# EasyEDA Pro project ProPrj_SCH_usb_board_2025-02-15.epro

# Schematic joystick_board
Board Name: joystick_board; Create Date: 2025-02-15; Page Name: Sheet_1; Project Name: SCH_usb_board; Schematic Name: joystick_board; Update Date: 2025-02-15; Add into BOM: yes; Company: GJK; Convert to PCB: yes; Date: 2025-01-24; REV: 1.0; Sheet: 1/1
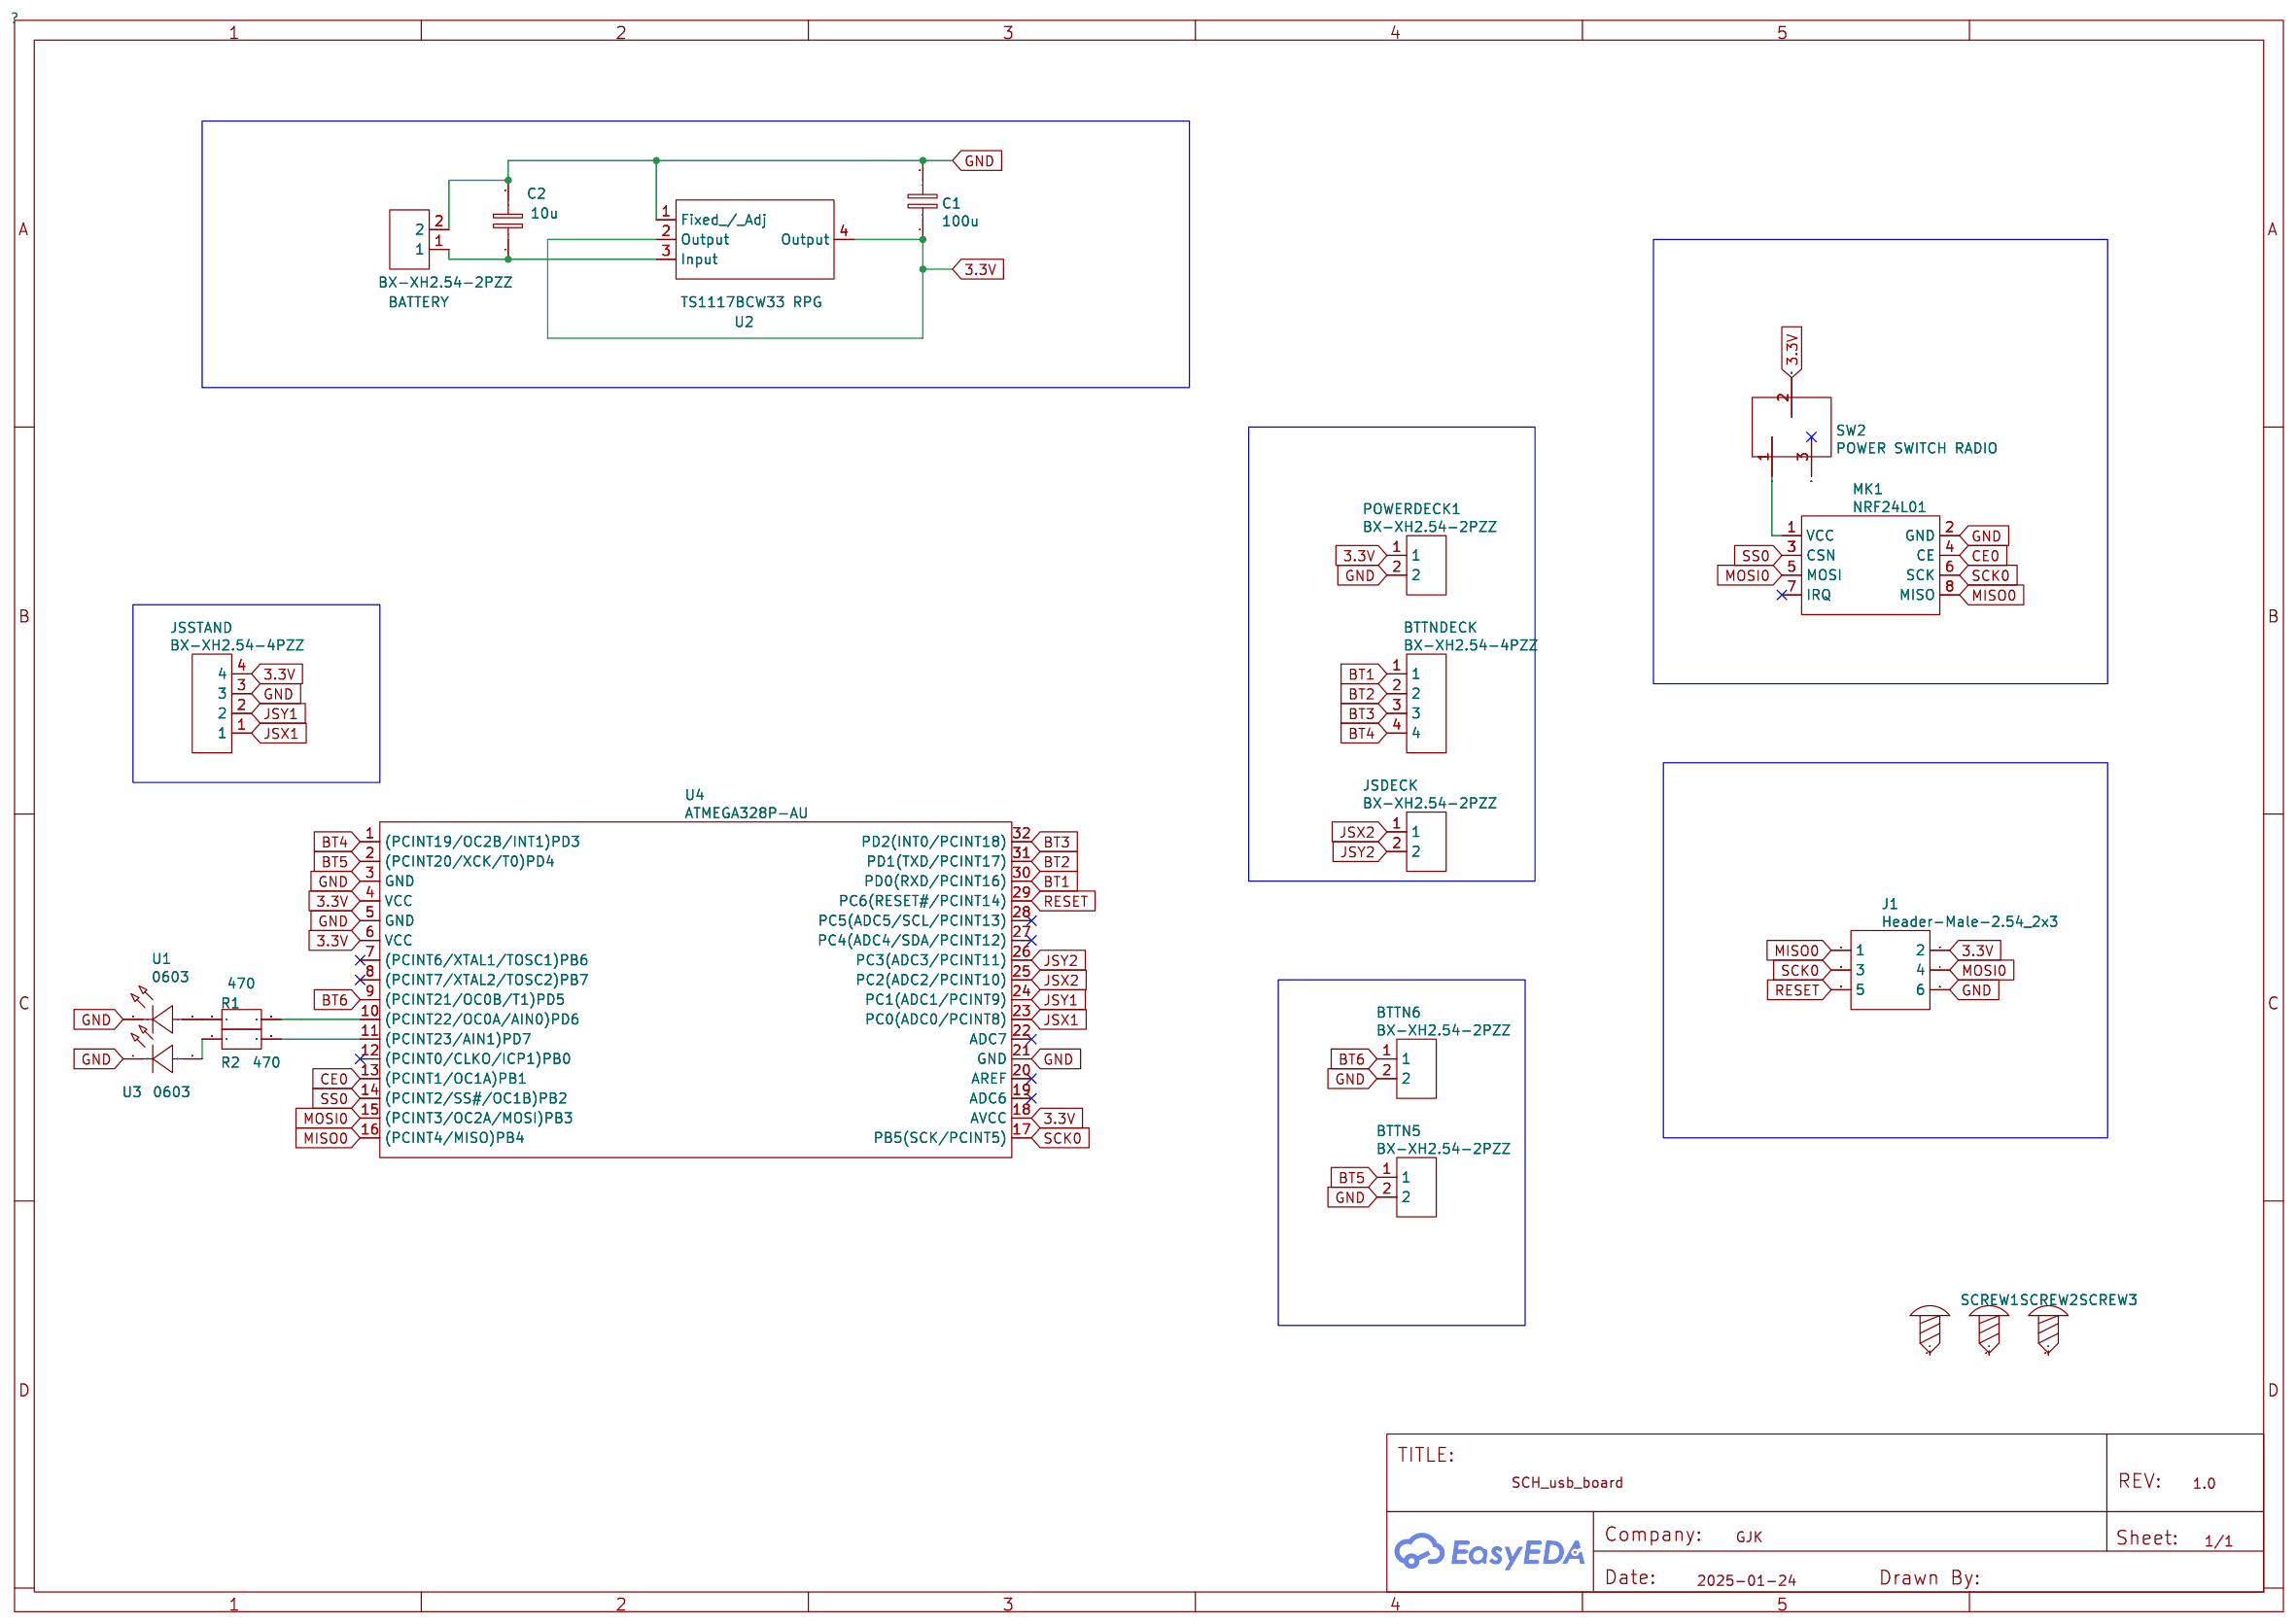
[diagram p0: schematic sheet]

## Parts
BATTERY  BX-XH2.54-2PZZ  [CONN-TH_2P-P2.50_BX-XH2.54-2PZZ]
BTTN5  BX-XH2.54-2PZZ  [CONN-TH_2P-P2.50_BX-XH2.54-2PZZ]
BTTN6  BX-XH2.54-2PZZ  [CONN-TH_2P-P2.50_BX-XH2.54-2PZZ]
BTTNDECK  BX-XH2.54-4PZZ  [CONN-TH_4P-P2.50_BX-XH2.54-4PZZ]
C1  100u  [C0603]
C2  10u  [C0603]
J1  Header-Male-2.54_2x3  [HDR-TH_6P-P2.54-V-M-R2-C3-S2.54-1]
JSDECK  BX-XH2.54-2PZZ  [CONN-TH_2P-P2.50_BX-XH2.54-2PZZ]
JSSTAND  BX-XH2.54-4PZZ  [CONN-TH_4P-P2.50_BX-XH2.54-4PZZ]
MK1  NRF24L01  [WIRELM-SMD_NRF24L01]
POWERDECK1  BX-XH2.54-2PZZ  [CONN-TH_2P-P2.50_BX-XH2.54-2PZZ]
R1  470  [R0603]
R2  470  [R0603]
SCREW1  -  [Screw-Hole-M3]
SCREW2  -  [Screw-Hole-M3]
SCREW3  -  [Screw-Hole-M3]
SW2  POWER SWITCH RADIO
U1  0603  [LED0603-RD_RED]
U2  TS1117BCW33 RPG  [SOT-223_L6.5-W3.5-P2.30-LS7.0-BR]
U3  0603  [LED0603-RD_RED]
U4  ATMEGA328P-AU  [TQFP-32_L7.0-W7.0-P0.80-LS9.0-BL]

## Library data of the parts
BATTERY BTTN5 BTTN6 JSDECK POWERDECK1 = BX-XH2.54-2PZZ: Supplier: LCSC; Supplier Part: C18077833; Manufacturer: Bossie(博锡); JLCPCB Part Class: Extended Part
BTTNDECK JSSTAND = BX-XH2.54-4PZZ: Supplier: LCSC; Supplier Part: C18077835; Manufacturer: Bossie(博锡); JLCPCB Part Class: Extended Part
C1 = 100u
C2 = 10u
J1 = Header-Male-2.54_2x3: Supplier: LCSC; Manufacturer: BOOMELE(博穆精密); Manufacturer Part: 2.54-2*3P针; Supplier Part: C65114; JLCPCB Part Class: Extended Part
MK1 = NRF24L01: Supplier: LCSC; Manufacturer: Ai-Thinker(安信可); Manufacturer Part: NF-04; Supplier Part: C90751; JLCPCB Part Class: Extended Part
R1 R2 = 470
SCREW1-SCREW3 = Screw-Hole-M3: Supplier Footprint: 插件
SW2 = POWER SWITCH RADIO: Supplier: LCSC; Manufacturer: KE; Manufacturer Part: DIP switch 8bit,Dip Switch,DSWB03LHGET; Supplier Part: C99420
U1 U3 = 0603: Supplier: LCSC; Supplier Part: C9900014602; Manufacturer: null; JLCPCB Part Class: Extended Part
U2 = TS1117BCW33 RPG: Supplier: LCSC; Supplier Part: C410833; Manufacturer: Taiwan Semiconductor(台湾半导体); JLCPCB Part Class: Extended Part
U4 = ATMEGA328P-AU: Supplier: LCSC; Manufacturer: MICROCHIP(美国微芯); Supplier Part: C14877; JLCPCB Part Class: Extended Part

## Nets
3.3V: C1.1 J1.2 JSSTAND.4 POWERDECK1.1 SW2.2(P2) U2.2(Output) U2.4(Output) U4.4(VCC) U4.6(VCC) U4.18(AVCC)
GND: BATTERY.2 BTTN5.2 BTTN6.2 C1.2 C2.2 J1.6 JSSTAND.3 MK1.2(GND) POWERDECK1.2 U1.1(K) U2.1(Fixed / Adj) U3.1(K) U4.3(GND) U4.5(GND) U4.21(GND)
BT1: BTTNDECK.1 U4.30(PD0(RXD/PCINT16))
BT2: BTTNDECK.2 U4.31(PD1(TXD/PCINT17))
BT3: BTTNDECK.3 U4.32(PD2(INT0/PCINT18))
BT4: BTTNDECK.4 U4.1((PCINT19/OC2B/INT1)PD3)
BT5: BTTN5.1 U4.2((PCINT20/XCK/T0)PD4)
BT6: BTTN6.1 U4.9((PCINT21/OC0B/T1)PD5)
CE0: MK1.4(CE) U4.13((PCINT1/OC1A)PB1)
JSX1: JSSTAND.1 U4.23(PC0(ADC0/PCINT8))
JSX2: JSDECK.1 U4.25(PC2(ADC2/PCINT10))
JSY1: JSSTAND.2 U4.24(PC1(ADC1/PCINT9))
JSY2: JSDECK.2 U4.26(PC3(ADC3/PCINT11))
MISO0: J1.1 MK1.8(MISO) U4.16((PCINT4/MISO)PB4)
MOSI0: J1.4 MK1.5(MOSI) U4.15((PCINT3/OC2A/MOSI)PB3)
RESET: J1.5 U4.29(PC6(RESET#/PCINT14))
SCK0: J1.3 MK1.6(SCK) U4.17(PB5(SCK/PCINT5))
SS0: MK1.3(CSN) U4.14((PCINT2/SS#/OC1B)PB2)
Net-(MK1-1): MK1.1(VCC) SW2.1(P1)
R2_1: R2.1 U3.2(A)
U1_2: R1.1 U1.2(A)
U2_3: BATTERY.1 C2.1 U2.3(Input)
U4_10: R1.2 U4.10((PCINT22/OC0A/AIN0)PD6)
U4_11: R2.2 U4.11((PCINT23/AIN1)PD7)

Not connected (* = marked no-connect by the designer): MK1 7(IRQ)*; SCREW1 1; SCREW2 1; SCREW3 1; SW2 3(P3)*; U4 7((PCINT6/XTAL1/TOSC1)PB6)* 8((PCINT7/XTAL2/TOSC2)PB7)* 12((PCINT0/CLKO/ICP1)PB0)* 19(ADC6)* 20(AREF)* 22(ADC7)* 27(PC4(ADC4/SDA/PCINT12))* 28(PC5(ADC5/SCL/PCINT13))*

# Schematic usb_board_32u4
Board Name: usb_board_32u4; Create Date: 2025-02-15; Page Name: Sheet_1; Project Name: SCH_usb_board; Schematic Name: usb_board_32u4; Update Date: 2025-02-15; Add into BOM: yes; Company: Your Company; Convert to PCB: yes; Date: 2025-02-09; REV: 1.0; Sheet: 1/1
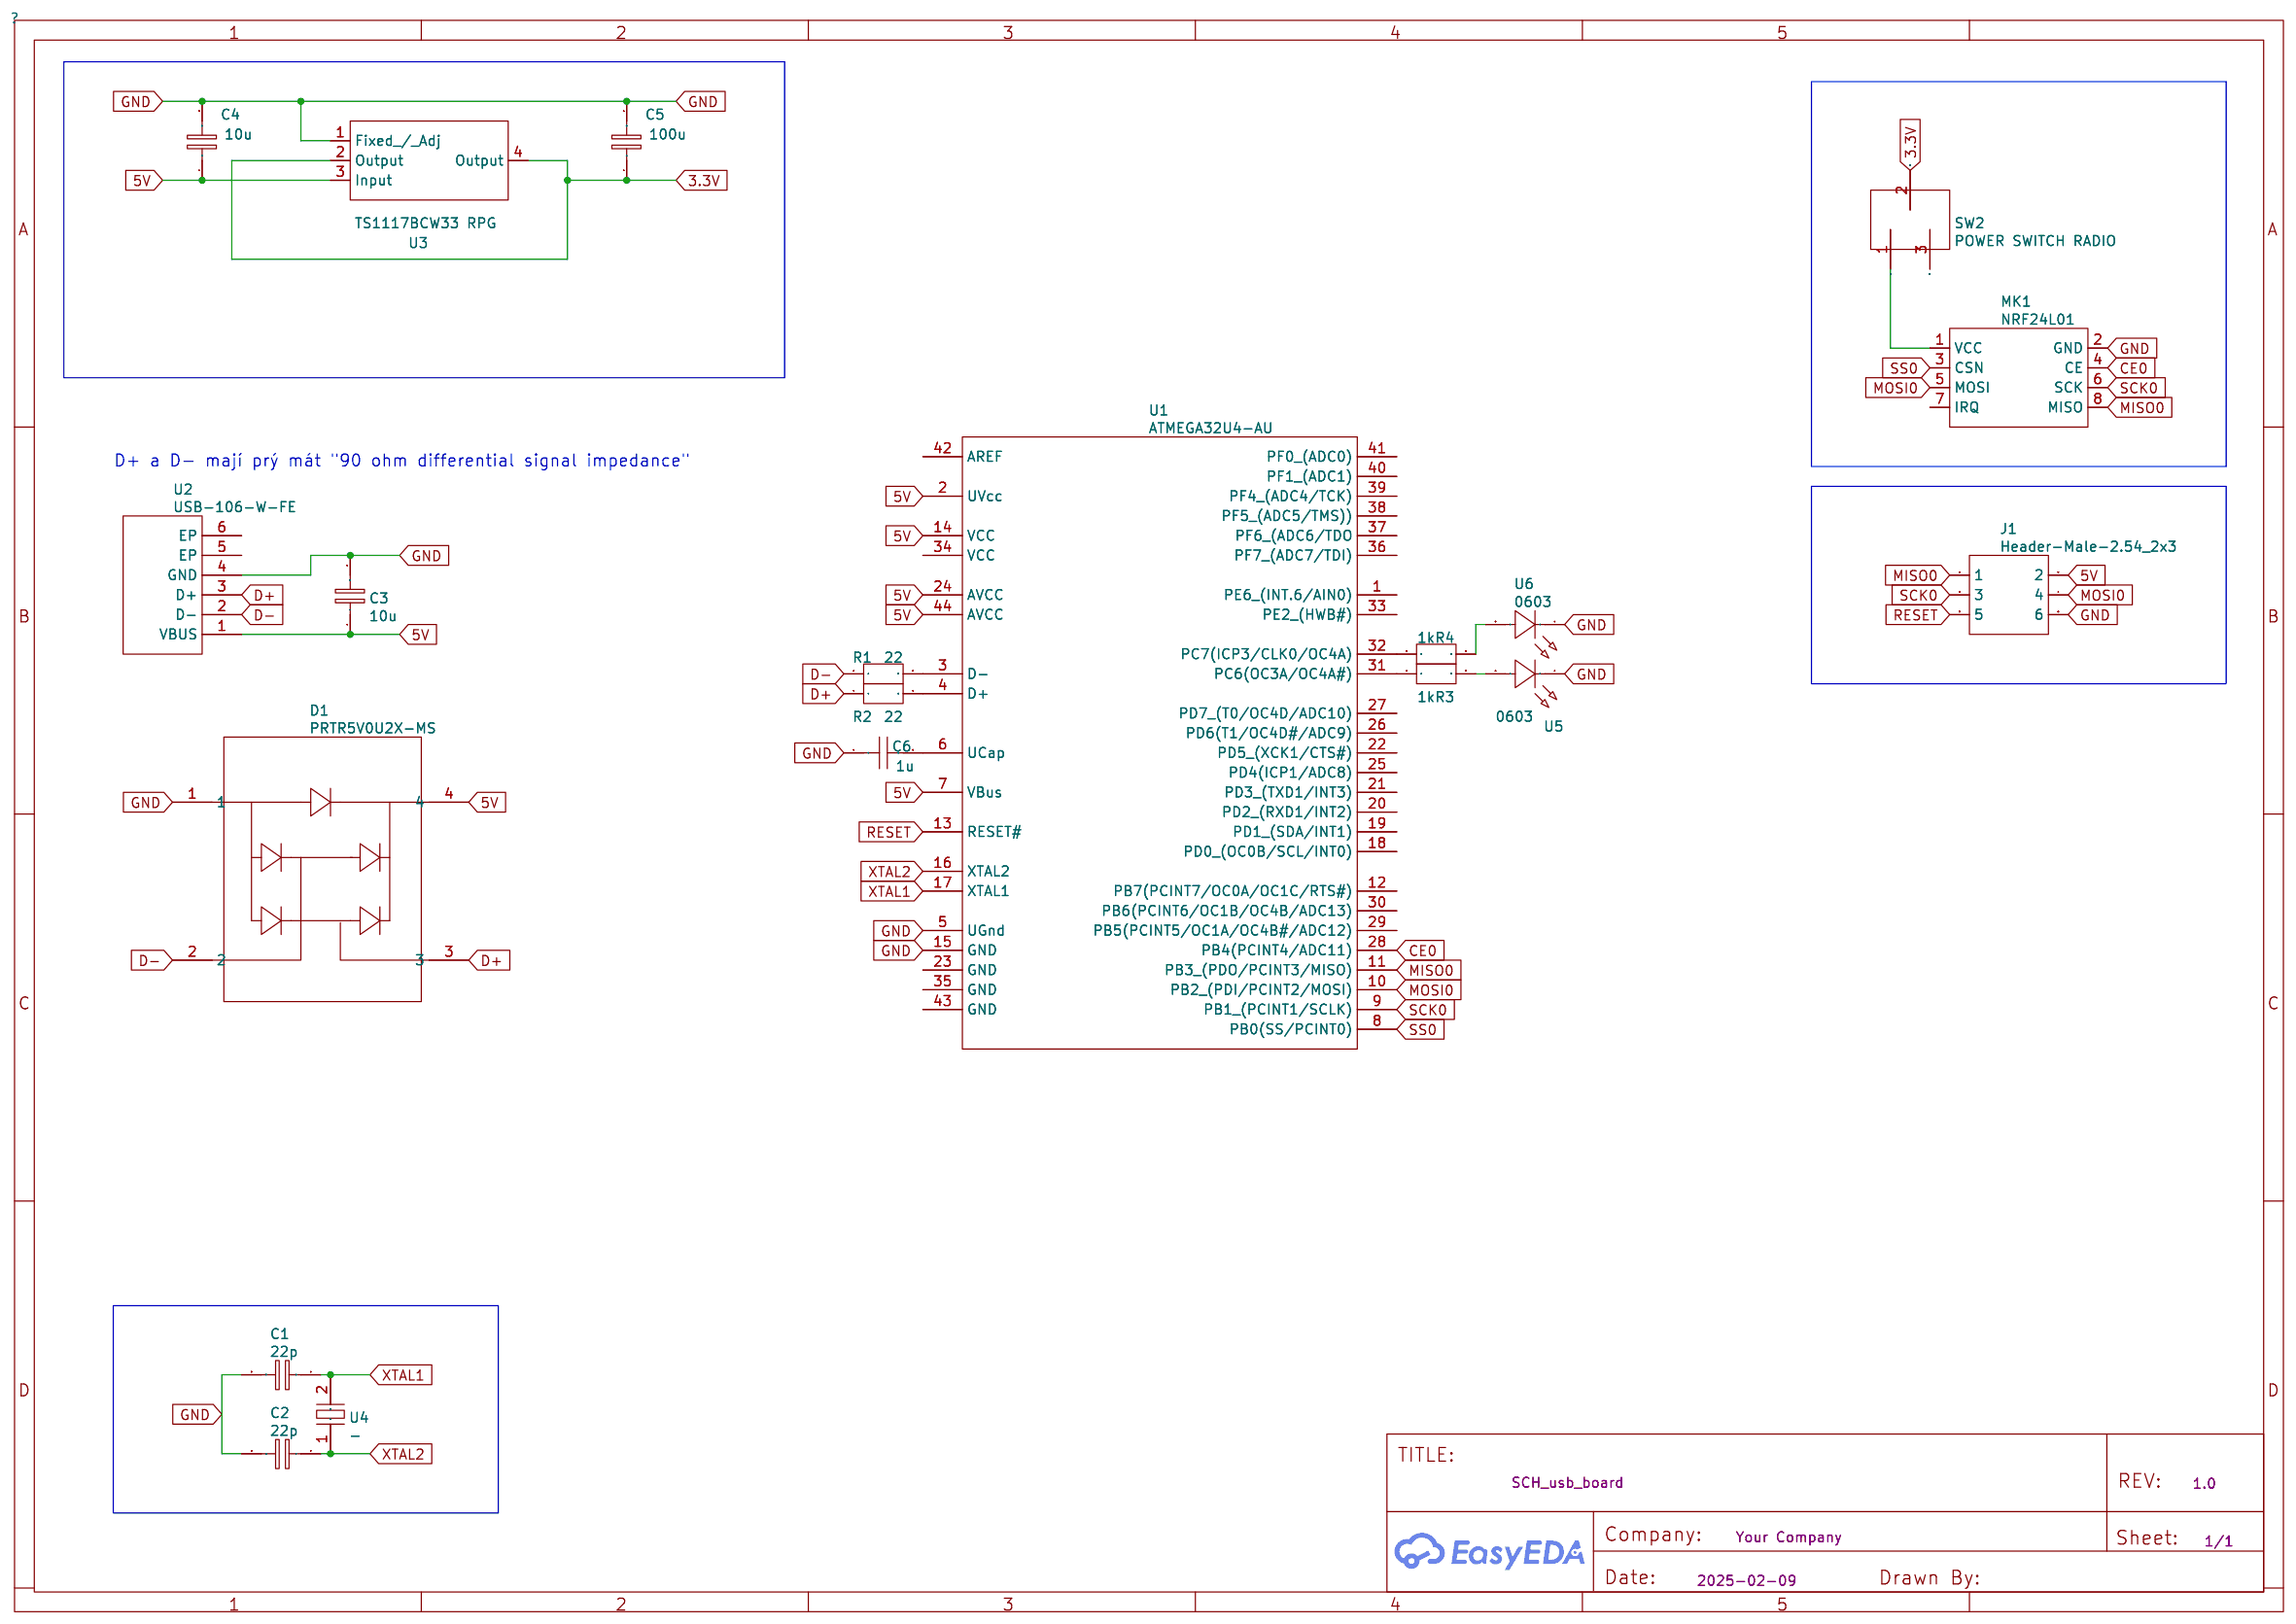
[diagram p1: schematic sheet]

## Parts
C1  22p  [C0603]
C2  22p  [C0603]
C3  10u  [C0603]
C4  10u  [C0603]
C5  100u  [C0603]
C6  1u  [C0603]
D1  PRTR5V0U2X-MS  [SOT-143-4_L2.9-W1.3-P1.92-LS2.4-BL]
J1  Header-Male-2.54_2x3  [HDR-TH_6P-P2.54-V-M-R2-C3-S2.54-1]
MK1  NRF24L01  [WIRELM-SMD_NRF24L01]
R1  22  [R0603]
R2  22  [R0603]
R3  1k  [R0603]
R4  1k  [R0603]
SW2  POWER SWITCH RADIO
U1  ATMEGA32U4-AU  [QFP-44_L10.0-W10.0-P0.80-LS13.2-BL]
U2  USB-106-W-FE  [USB-A-TH_USB-106]
U3  TS1117BCW33 RPG  [SOT-223_L6.5-W3.5-P2.30-LS7.0-BR]
U4  -  [HC-49SMD_L11.1-W4.8]
U5  0603  [LED0603-RD_RED]
U6  0603  [LED0603-RD_RED]

## Library data of the parts
C1 C2 = 22p
C3 C4 = 10u
C5 = 100u
C6 = 1u
D1 = PRTR5V0U2X-MS: Supplier: LCSC; Supplier Part: C2836313; Manufacturer: MSKSEMI(美森科); JLCPCB Part Class: Extended Part
J1 = Header-Male-2.54_2x3: Supplier: LCSC; Manufacturer: BOOMELE(博穆精密); Manufacturer Part: 2.54-2*3P针; Supplier Part: C65114; JLCPCB Part Class: Extended Part
MK1 = NRF24L01: Supplier: LCSC; Manufacturer: Ai-Thinker(安信可); Manufacturer Part: NF-04; Supplier Part: C90751; JLCPCB Part Class: Extended Part
R1 R2 = 22
R3 R4 = 1k
SW2 = POWER SWITCH RADIO: Supplier: LCSC; Manufacturer: KE; Manufacturer Part: DIP switch 8bit,Dip Switch,DSWB03LHGET; Supplier Part: C99420
U1 = ATMEGA32U4-AU: Supplier: LCSC; Manufacturer: MICROCHIP(美国微芯); Supplier Part: C44854; JLCPCB Part Class: Extended Part
U2 = USB-106-W-FE: Supplier: LCSC; Supplier Part: C2939557; Manufacturer: HOOYA(皓宇电子)
U3 = TS1117BCW33 RPG: Supplier: LCSC; Supplier Part: C410833; Manufacturer: Taiwan Semiconductor(台湾半导体); JLCPCB Part Class: Extended Part
U4 = -: Supplier: LCSC; Supplier Part: C712789; Manufacturer: CJ(江苏长电/长晶); Manufacturer Part: CJ03-2211842020A20; JLCPCB Part Class: Extended Part
U5 U6 = 0603: Supplier: LCSC; Supplier Part: C9900014602; Manufacturer: null; JLCPCB Part Class: Extended Part

## Nets
3.3V: C5.1 SW2.2(P2) U3.2(Output) U3.4(Output)
5V: C3.1 C4.1 D1.4 J1.2 U1.2(UVcc) U1.7(VBus) U1.14(VCC) U1.24(AVCC) U1.44(AVCC) U2.1(VBUS) U3.3(Input)
GND: C1.2 C2.2 C3.2 C4.2 C5.2 C6.1 D1.1 J1.6 MK1.2(GND) U1.5(UGnd) U1.15(GND) U2.4(GND) U3.1(Fixed / Adj) U5.1(K) U6.1(K)
CE0: MK1.4(CE) U1.28(PB4(PCINT4/ADC11))
D+: D1.3 R2.1 U2.3(D+)
D-: D1.2 R1.1 U2.2(D-)
MISO0: J1.1 MK1.8(MISO) U1.11(PB3 (PDO/PCINT3/MISO))
MOSI0: J1.4 MK1.5(MOSI) U1.10(PB2 (PDI/PCINT2/MOSI))
RESET: J1.5 U1.13(RESET#)
SCK0: J1.3 MK1.6(SCK) U1.9(PB1 (PCINT1/SCLK))
SS0: MK1.3(CSN) U1.8(PB0(SS/PCINT0))
XTAL1: C1.1 U1.17(XTAL1) U4.2(GND)
XTAL2: C2.1 U1.16(XTAL2) U4.1
MK1_1: MK1.1(VCC) SW2.1(P1)
Net-(R3-1): R3.1 U1.31(PC6(OC3A/OC4A#))
Net-(R3-2): R3.2 U5.2(A)
Net-(R4-1): R4.1 U1.32(PC7(ICP3/CLK0/OC4A))
Net-(R4-2): R4.2 U6.2(A)
U1_3: R1.2 U1.3(D-)
U1_4: R2.2 U1.4(D+)
U1_6: C6.2 U1.6(UCap)

Not connected (* = marked no-connect by the designer): MK1 7(IRQ); SW2 3(P3); U1 1(PE6 (INT.6/AIN0)) 12(PB7(PCINT7/OC0A/OC1C/RTS#)) 18(PD0 (OC0B/SCL/INT0)) 19(PD1 (SDA/INT1)) 20(PD2 (RXD1/INT2)) 21(PD3 (TXD1/INT3)) 22(PD5 (XCK1/CTS#)) 23(GND) 25(PD4(ICP1/ADC8)) 26(PD6(T1/OC4D#/ADC9)) 27(PD7 (T0/OC4D/ADC10)) 29(PB5(PCINT5/OC1A/OC4B#/ADC12)) 30(PB6(PCINT6/OC1B/OC4B/ADC13)) 33(PE2 (HWB#)) 34(VCC) 35(GND) 36(PF7 (ADC7/TDI)) 37(PF6 (ADC6/TDO) 38(PF5 (ADC5/TMS))) 39(PF4 (ADC4/TCK)) 40(PF1 (ADC1)) 41(PF0 (ADC0)) 42(AREF) 43(GND); U2 5(EP) 6(EP)

## Notes on the sheet
- D+ a D- mají prý mát "90 ohm differential signal impedance"

# Board usb_board2_PCB
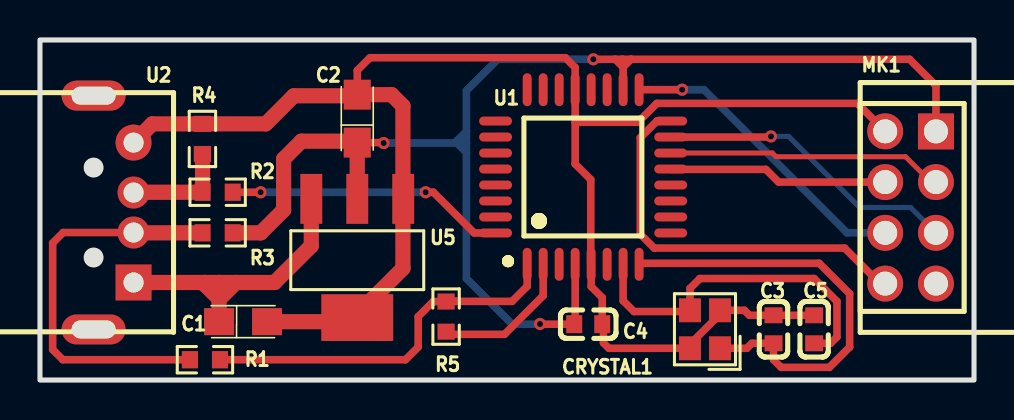
[diagram p2: board, top side]
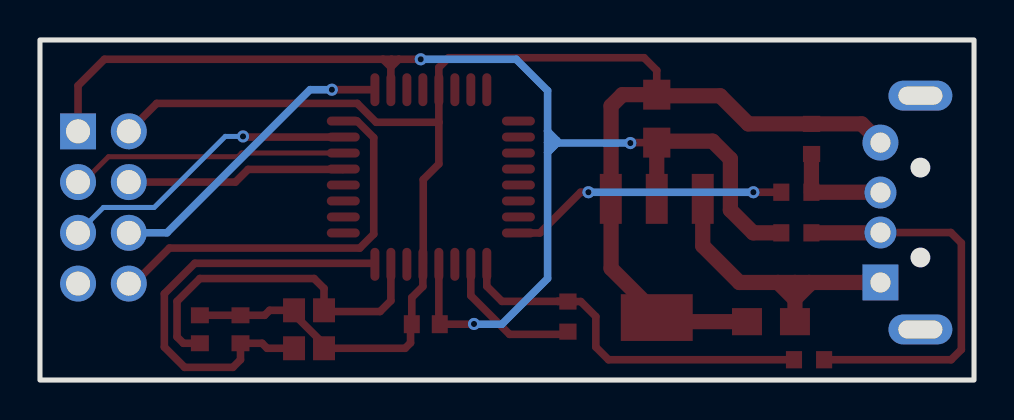
[diagram p3: board, bottom side, seen from below]

Outline 46.74 x 17.02 mm; copper layers: Top Layer, Bottom Layer. Coordinates in mm from the lower left corner of the outline.
Outline path: rectangle 0,17.02 46.74,0
Stack: Top Layer 0.035mm / Dielectric1 1.51mm FR4 er 4.5 / Bottom Layer 0.035mm

## Design rules (mm)
template: JLCPCB Capability(Two Layers Board)
spacing copperThickness1oz (default): track to track 0.102, other pairs 0.152 to 0.3
spacing copperThickness2oz: track to track 0.203, other pairs 0.152 to 0.3
track width copperThickness1oz (default): min 0.127, default 0.254, max 2.54
track width copperThickness2oz: min 0.203, default 0.254, max 2.54
differential pair differentialPair (default): width min 0.127, default 0.254, max 2.54; gap min 0.152, default 0.152
via viaSize (default): diameter min 0.5, default 0.61, max 10; hole min 0.3, default 0.305, max 6.3

## Placement (name value [footprint] x y rotation side)
C1  4u7  [CASE-A_3216]  10.16 2.92 0 top
C2  1u  [CASE-A_3216]  15.88 13.08 90 top
C3  22pF  [C0603]  36.7 2.54 90 top
C4  100n  [C0603]  27.43 2.79 0 top
C5  22pF  [C0603]  38.74 2.54 90 top
CRYSTAL1  16MHz  [CRYSTAL-SMD_4P-L2.5-W2.0-BL]  33.27 2.54 90 top
MK1  NRF24L01  [WIRELM-SMD_NRF24L01]  43.56 8.64 90 top
R1  68R  [R0603]  8.25 1.02 0 top
R2  68R  [R0603]  8.89 9.4 0 top
R3  1k5  [R0603]  8.89 7.37 0 top
R4  1M  [R0603]  8.13 12.06 270 top
R5  1k5  [R0603]  20.32 3.17 90 top
U1  ATMEGA328PB-AU  [TQFP-32_L7.0-W7.0-P0.80-LS9.0-BL]  27.18 10.16 0 top
U2  USB-106-W-FE  [USB-A-TH_USB-106]  3.68 8.38 270 top
U5  AMS1117-3.3  [SOT-223-3_L6.5-W3.4-P2.30-LS7.0-BR]  15.88 6.1 90 top

## Footprints (pads in the part's own frame, mm; a bottom-side part is the same pattern mirrored in y, then rotated)
C0603
  rect 0.8x0.9 smd: 1(-0.7,0) 2(0.7,0)
CASE-A_3216
  rect 1.5x1.359 smd: 1(-1.2,0) 2(1.2,0)
CRYSTAL-SMD_4P-L2.5-W2.0-BL
  rect 1.2x1.1 smd: 1(-0.95,-0.75) 2(0.95,-0.75) 3(0.95,0.75) 4(-0.95,0.75)
R0603
  rect 0.806x0.864 smd: 1(-0.753,0) 2(0.753,0)
SOT-223-3_L6.5-W3.4-P2.30-LS7.0-BR
  rect 2.5x1.1 smd: 1(2.97,-2.3) 2(2.97,0) 3(2.97,2.3)
  rect 2.34x3.6 smd: 4(-2.97,0)
TQFP-32_L7.0-W7.0-P0.80-LS9.0-BL
  oval 0.45x1.65 smd: 1(-2.8,-4.369) 2(-2,-4.369) 3(-1.2,-4.369) 4(-0.4,-4.369) 5(0.4,-4.369) 6(1.2,-4.369) 7(2,-4.369) 8(2.8,-4.369) 17(2.8,4.369) 18(2,4.369) 19(1.2,4.369) 20(0.4,4.369) 21(-0.4,4.369) 22(-1.2,4.369) 23(-2,4.369) 24(-2.8,4.369)
  oval 1.65x0.45 smd: 9(4.381,-2.8) 10(4.381,-2) 11(4.381,-1.2) 12(4.381,-0.4) 13(4.381,0.4) 14(4.381,1.2) 15(4.381,2) 16(4.381,2.8) 25(-4.381,2.8) 26(-4.381,2) 27(-4.381,1.2) 28(-4.381,0.4) 29(-4.381,-0.4) 30(-4.381,-1.2) 31(-4.381,-2) 32(-4.381,-2.8)
USB-A-TH_USB-106
  rect 1.8x1.8 hole 1: 1(3.5,1)
  round 1.6 hole 1: 2(1,1) 3(-1,1)
  round 1.8 hole 1: 4(-3.5,1)
  oval 1.5x3.2 hole 0.9x2.2: 5(-5.85,-1) 6(5.85,-1)
WIRELM-SMD_NRF24L01
  rect 1.8x1.8 hole 1.2: 1(3.808,-1.27)
  round 1.8 hole 1.2: 2(3.81,1.27) 3(1.27,-1.27) 4(1.27,1.27) 5(-1.27,-1.27) 6(-1.27,1.27) 7(-3.81,-1.27) 8(-3.81,1.27)

## Nets
3.3V: C2.1 C4.1 MK1.1 R3.2 U1.4 U1.18 U5.2
GND: C1.2 C2.2 C3.2 C4.2 C5.2 CRYSTAL1.2 CRYSTAL1.4 MK1.2 R4.1 U1.5 U1.21 U2.4 U5.1 U5.4
CE0: MK1.4 U1.13
D+: R2.1 R4.2 U2.3
D-: R1.1 R3.1 U2.2
MISO0: MK1.8 U1.16
MOSI0: MK1.5 U1.15
PD+: R2.2 U1.32
PD-: R1.2 R5.2 U1.1
SCK0: MK1.6 U1.17
SS0: MK1.3 U1.14
$1N1: C1.1 U2.1 U5.3
$1N9: C5.1 CRYSTAL1.3 U1.7
$1N10: C3.1 CRYSTAL1.1 U1.8
$1N322: R5.1 U1.2

Pads without a net: MK1 7; U1 3 6 9 10 11 12 19 20 22 23 24 25 26 27 28 29 30 31; U2 5 6

## Via types
v1: diameter 0.61, hole 0.305, Top Layer to Bottom Layer, 7 vias

## Routing (per net, layer and track width the routed paths; a pad name or vN(x,y) marks a point on that pad's centre or on a via; arc(x,y) is an arc through that point)
3.3V: length 67.8
  Top Layer w0.381: v1(17.2,11.86) 17.18,11.88 C2.1 ; v1(27.69,16.05) 28.78,16.05 ; 28.78,16.05 29.18,15.66 ; 28.78,16.05 29.15,16.05 ; 29.15,16.05 29.18,16.02 29.18,15.66 ; 29.15,16.05 29.57,16.05 ; MK1.1 44.83,14.73 43.51,16.05 29.57,16.05 ; 29.18,15.66 29.57,16.05 ; 29.18,15.66 U1.18 ; v1(25.02,2.81) 25.03,2.79 C4.1 26.78,2.84 U1.4
  Top Layer w0.762: R3.2 11.05,7.37 12.19,8.51 12.19,11.06 13.08,11.95 15.8,11.95 C2.1 U5.2
  Bottom Layer w0.381: 21.34,11.88 21.34,12.45 ; 21.34,11.88 21.32,11.86 20.86,11.86 ; 21.34,11.88 21.34,11.39 ; 21.34,12.45 21.34,14.48 22.91,16.05 v1(27.69,16.05) ; 21.34,12.45 20.86,11.97 20.86,11.86 ; 20.86,11.86 20.86,11.86 ; 20.86,11.86 21.34,11.39 ; 20.86,11.86 v1(17.2,11.86) ; 21.34,11.39 21.34,5.08 23.62,2.79 25.01,2.79 v1(25.02,2.81)
GND: length 86.1
  Top Layer w0.381: 26.78,12.9 26.78,10.81 27.56,10.03 27.56,5.81 U1.5 27.58,4.68 28.13,4.13 28.13,2.79 28.19,2.73 28.19,1.86 28.46,1.59 CRYSTAL1.4 32.52,1.79 34.02,3.29 CRYSTAL1.2 35.25,3.49 35.5,3.24 C3.2 C5.2 ; 26.78,12.9 U1.21 26.78,15.64 26.29,16.13 16.51,16.13 15.88,15.49 C2.2 ; 26.78,12.9 29.92,12.9 30.86,13.84 40.89,13.84 MK1.2
  Top Layer w0.762: 18.16,9.07 18.16,5.59 15.88,3.3 U5.4 15.67,2.92 11.36,2.92 ; U5.1 18.16,9.08 18.16,13.72 17.6,14.28 C2.2 15.82,14.22 12.7,14.22 11.29,12.82 R4.1 5.62,12.82 U2.4
CE0: length 11
  Top Layer w0.381: MK1.4 36.96,9.91 36.32,10.54 31.58,10.54 U1.13
D+: length 5.4
  Top Layer w0.762: R4.2 8.14,11.3 R2.1 4.7,9.4 U2.3
D-: length 20
  Top Layer w0.381: R1.1 1.14,1.02 0.64,1.52 0.64,6.86 1.16,7.38 U2.2
  Top Layer w0.762: 8.01,7.37 4.7,7.37 U2.2
MISO0: length 20
  Top Layer w0.381: MK1.8 42.04,4.83 40.26,6.6 30.73,6.6 30.04,7.3 30.04,12.13 30.87,12.96 U1.16
MOSI0: length 15.3
  Top Layer w0.381: v1(36.58,12.19) 36.54,12.16 U1.15
  Bottom Layer w0.254: MK1.5 43.56,8.64 41.02,8.64 37.47,12.19 v1(36.58,12.19)
PD+: length 14
  Top Layer w0.381: U1.32 21.72,7.36 19.69,9.4 v1(19.3,9.4) ; v1(11.04,9.4) R2.2
  Bottom Layer w0.381: v1(11.04,9.4) v1(19.3,9.4)
PD-: length 19.8
  Top Layer w0.381: 19.94,3.93 19.68,3.93 18.92,3.17 18.92,1.65 18.29,1.02 R1.2 ; 19.94,3.93 20.33,3.94 ; 19.94,3.93 R5.2 ; R5.2 20.33,3.94 ; R5.2 20.83,3.94 ; 20.33,3.94 20.83,3.94 ; U1.1 24.38,4.69 23.62,3.94 20.83,3.94
SCK0: length 15.3
  Top Layer w0.381: U1.17 v1(32.13,14.53)
  Bottom Layer w0.381: MK1.6 40.39,7.37 33.22,14.53 v1(32.13,14.53)
SS0: length 13.9
  Top Layer w0.254: MK1.3 44.58,9.91 43.31,11.18 36.83,11.18 36.65,11.36 U1.14
$1N1: length 16.3
  Top Layer w0.762: 8.96,4.06 8.99,4.06 9.81,4.88 ; 8.96,4.06 8.25,4.77 8.25,4.88 ; 8.96,4.06 8.96,4.88 8.96,4.88 ; 8.96,4.06 C1.1 ; 8.96,4.88 9.81,4.88 ; 8.96,4.88 8.25,4.88 ; 9.81,4.88 11.74,4.88 13.57,6.72 U5.3 ; 8.25,4.88 U2.1
$1N9: length 17.6
  Top Layer w0.381: C5.1 39.56,1.84 39.88,2.16 39.88,3.94 38.74,5.08 33.02,5.08 32.52,4.58 CRYSTAL1.3 32.46,3.43 29.72,3.43 29.18,3.97 U1.7
$1N10: length 21.8
  Top Layer w0.381: U1.8 30.03,5.84 38.99,5.84 40.51,4.32 40.51,1.65 39.5,0.63 37.08,0.63 36.7,1.02 C3.1 35.62,1.84 35.37,1.59 CRYSTAL1.1
$1N322: length 7.3
  Top Layer w0.381: R5.1 20.46,2.29 23.24,2.29 25.18,4.22 U1.2

# Board joystick_board_PCB
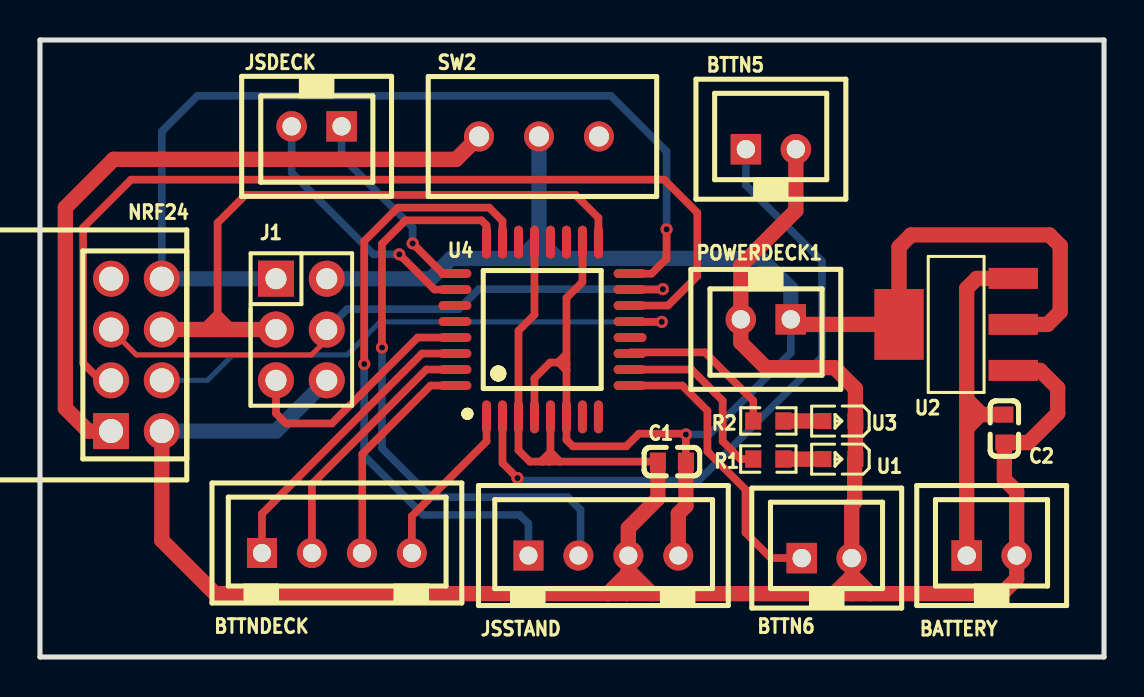
[diagram p4: board, top side]
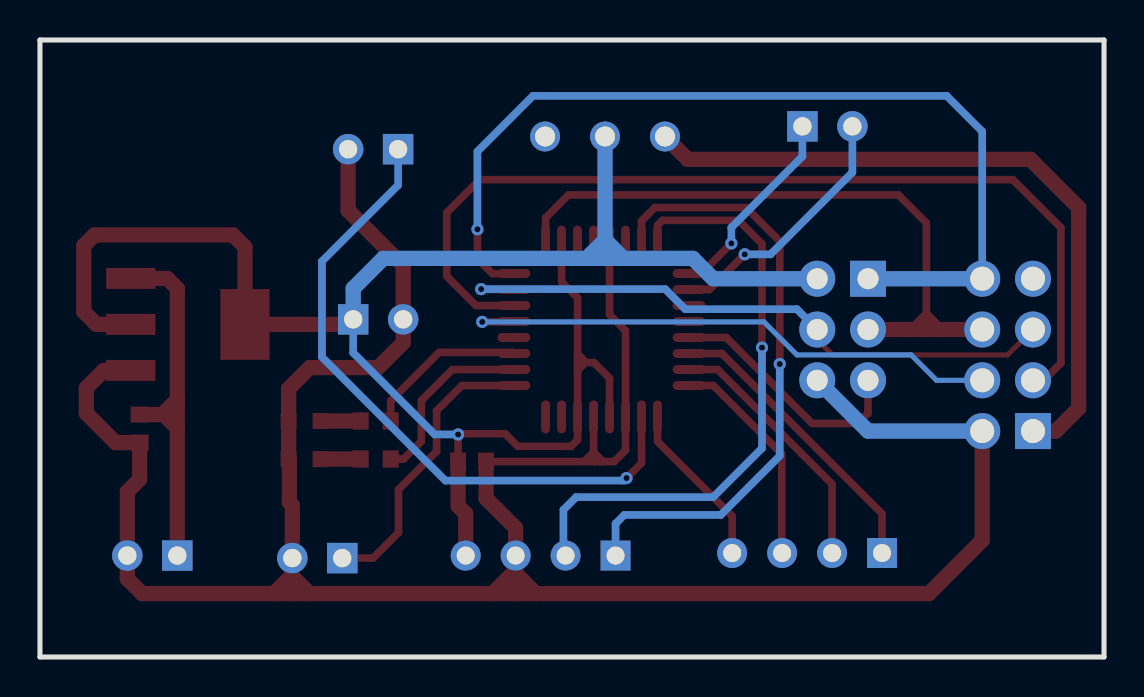
[diagram p5: board, bottom side, seen from below]

Outline 53.25 x 30.85 mm; copper layers: Top Layer, Bottom Layer. Coordinates in mm from the lower left corner of the outline.
Outline path: 0,30.85 53.25,30.85 53.25,0 0,0 0,30.85
Stack: Top Layer 0.035mm / Dielectric1 1.51mm FR4 er 4.5 / Bottom Layer 0.035mm

## Design rules (mm)
spacing Default (default): track to track 0.152, other pairs 0 to 0.152
track width Default (default): min 0.254, default 0.254, max 25.4
differential pair differentialPair (default): width min 0.127, default 0.254, max 2.54; gap min 0.152, default 0.152
via Default (default): diameter min 0.61, default 0.61, max 100.025; hole min 0.305, default 0.305, max 59.995

## Placement (name value [footprint] x y rotation side)
BATTERY  BX-XH2.54-2PZZ  [CONN-TH_2P-P2.50_BX-XH2.54-2PZZ]  47.62 5.07 0 top
BTTN5  BX-XH2.54-2PZZ  [CONN-TH_2P-P2.50_BX-XH2.54-2PZZ]  36.58 25.39 0 top
BTTN6  BX-XH2.54-2PZZ  [CONN-TH_2P-P2.50_BX-XH2.54-2PZZ]  39.37 4.95 0 top
BTTNDECK  BX-XH2.54-4PZZ  [CONN-TH_4P-P2.50_BX-XH2.54-4PZZ]  14.86 5.2 0 top
C1  100u  [C0603]  31.62 9.77 180 top
C2  10u  [C0603]  48.26 11.42 270 top
J1  Header-Male-2.54_2x3  [HDR-TH_6P-P2.54-V-M-R2-C3-S2.54-1]  13.08 16.38 270 top
JSDECK  BX-XH2.54-2PZZ  [CONN-TH_2P-P2.50_BX-XH2.54-2PZZ]  13.84 26.54 180 top
JSSTAND  BX-XH2.54-4PZZ  [CONN-TH_4P-P2.50_BX-XH2.54-4PZZ]  28.19 5.07 0 top
NRF24  NRF24L01  [WIRELM-SMD_NRF24L01]  4.83 15.11 270 top
POWERDECK1  BX-XH2.54-2PZZ  [CONN-TH_2P-P2.50_BX-XH2.54-2PZZ]  36.32 16.88 180 top
R1  470  [R0603]  36.45 9.9 180 top
R2  470  [R0603]  36.45 11.8 180 top
SW2  POWER SWITCH RADIO  [KLS7-SS02-12F20 (1P2T)]  21.97 26.03 0 top
U1  0603  [LED0603-RD_RED]  40.01 9.9 180 top
U2  TS1117BCW33 RPG  [SOT-223_L6.5-W3.5-P2.30-LS7.0-BR]  45.85 16.63 0 top
U3  0603  [LED0603-RD_RED]  40.01 11.8 180 top
U4  ATMEGA328P-AU  [TQFP-32_L7.0-W7.0-P0.80-LS9.0-BL]  25.15 16.38 0 top

## Footprints (pads in the part's own frame, mm; a bottom-side part is the same pattern mirrored in y, then rotated)
C0603
  rect 0.8x0.9 smd: 1(-0.7,0) 2(0.7,0)
CONN-TH_2P-P2.50_BX-XH2.54-2PZZ
  rect 1.524x1.524 hole 0.914: 1(-1.25,0)
  round 1.524 hole 0.914: 2(1.25,0)
CONN-TH_4P-P2.50_BX-XH2.54-4PZZ
  rect 1.5x1.5 hole 0.9: 1(-3.75,0)
  round 1.5 hole 0.9: 2(-1.25,0) 3(1.25,0) 4(3.75,0)
HDR-TH_6P-P2.54-V-M-R2-C3-S2.54-1
  rect 1.8x1.8 hole 1.05: 1(-2.54,-1.27)
  round 1.8 hole 1.05: 2(-2.54,1.27) 3(0,-1.27) 4(0,1.27) 5(2.54,-1.27) 6(2.54,1.27)
KLS7-SS02-12F20 (1P2T)
  round 1.5 hole 1: 1(0,0) 2(3,0) 3(6,0)
LED0603-RD_RED
  rect 0.8x0.8 smd: 1(-0.799,-0.004) 2(0.799,0.004)
R0603
  rect 0.806x0.864 smd: 1(-0.753,0) 2(0.753,0)
SOT-223_L6.5-W3.5-P2.30-LS7.0-BR
  rect 2.465x1.05 smd: 1(2.857,-2.3) 2(2.857,0) 3(2.857,2.3)
  rect 2.465x3.54 smd: 4(-2.857,0)
TQFP-32_L7.0-W7.0-P0.80-LS9.0-BL
  oval 0.45x1.65 smd: 1(-2.8,-4.369) 2(-2,-4.369) 3(-1.2,-4.369) 4(-0.4,-4.369) 5(0.4,-4.369) 6(1.2,-4.369) 7(2,-4.369) 8(2.8,-4.369) 17(2.8,4.369) 18(2,4.369) 19(1.2,4.369) 20(0.4,4.369) 21(-0.4,4.369) 22(-1.2,4.369) 23(-2,4.369) 24(-2.8,4.369)
  oval 1.65x0.45 smd: 9(4.381,-2.8) 10(4.381,-2) 11(4.381,-1.2) 12(4.381,-0.4) 13(4.381,0.4) 14(4.381,1.2) 15(4.381,2) 16(4.381,2.8) 25(-4.381,2.8) 26(-4.381,2) 27(-4.381,1.2) 28(-4.381,0.4) 29(-4.381,-0.4) 30(-4.381,-1.2) 31(-4.381,-2) 32(-4.381,-2.8)
WIRELM-SMD_NRF24L01
  rect 1.8x1.8 hole 1.2: 1(3.808,-1.27)
  round 1.8 hole 1.2: 2(3.81,1.27) 3(1.27,-1.27) 4(1.27,1.27) 5(-1.27,-1.27) 6(-1.27,1.27) 7(-3.81,-1.27) 8(-3.81,1.27)

## Nets
3.3V: C1.1 J1.2 JSSTAND.4 POWERDECK1.1 SW2.2 U2.2 U2.4 U4.4 U4.6 U4.18
GND: BATTERY.2 BTTN5.2 BTTN6.2 C1.2 C2.2 J1.6 JSSTAND.3 NRF24.2 POWERDECK1.2 U1.1 U2.1 U3.1 U4.3 U4.5 U4.21
BT1: BTTNDECK.1 U4.30
BT2: BTTNDECK.2 U4.31
BT3: BTTNDECK.3 U4.32
BT4: BTTNDECK.4 U4.1
BT5: BTTN5.1 U4.2
BT6: BTTN6.1 U4.9
CE0: NRF24.4 U4.13
JSX1: JSSTAND.1 U4.23
JSX2: JSDECK.1 U4.25
JSY1: JSSTAND.2 U4.24
JSY2: JSDECK.2 U4.26
MISO0: J1.1 NRF24.8 U4.16
MK1_1: NRF24.1 SW2.1
MOSI0: J1.4 NRF24.5 U4.15
R2_1: R2.1 U3.2
RESET: J1.5 U4.29
SCK0: J1.3 NRF24.6 U4.17
SS0: NRF24.3 U4.14
U1_2: R1.1 U1.2
U2_3: BATTERY.1 C2.1 U2.3
U4_10: R1.2 U4.10
U4_11: R2.2 U4.11

Pads without a net: NRF24 7; SW2 3; U4 7 8 12 19 20 22 27 28

## Via types
v1: diameter 0.61, hole 0.305, Top Layer to Bottom Layer, 9 vias

## Routing (per net, layer and track width the routed paths; a pad name or vN(x,y) marks a point on that pad's centre or on a via; arc(x,y) is an arc through that point)
3.3V: length 94.9
  Top Layer w0.381: 25.95,14.73 25.95,14.76 26.35,15.16 ; 25.95,14.73 26.28,14.73 26.35,14.66 ; 25.95,14.73 26.35,14.33 ; 25.95,14.73 25.53,14.73 24.75,13.94 U4.4 ; 26.35,15.16 26.35,14.66 ; 26.35,15.16 26.35,17.96 27.15,18.76 U4.18 ; 26.35,14.66 26.35,14.33 ; C1.1 v1(32.32,11.13) 32.28,11.17 29.97,11.17 29.34,10.53 26.67,10.53 26.35,10.86 U4.6 26.35,14.33
  Top Layer w0.762: JSSTAND.4 31.94,7.17 32.32,7.55 C1.1 ; POWERDECK1.1 37.83,16.63 U2.4 42.99,20.5 43.59,21.11 50.52,21.11 51.05,20.57 51.05,17.27 50.42,16.63 U2.2
  Bottom Layer w0.381: v1(32.32,11.13) 33.49,11.13 37.57,15.21 POWERDECK1.1 ; J1.2 14.41,18.86
  Bottom Layer w0.762: 24.93,19.93 24.97,19.97 24.97,20.85 ; 24.93,19.93 24.05,19.93 ; 24.93,19.93 25.89,19.93 ; 24.97,20.85 25.89,19.93 ; 24.97,20.85 24.05,19.93 ; 24.97,20.85 SW2.2 ; 25.89,19.93 36.07,19.93 37.57,18.43 POWERDECK1.1 ; 24.05,19.93 20.57,19.93 19.56,18.92 J1.2
GND: length 135.2
  Top Layer w0.381: 25.55,10.25 25.55,9.85 25.47,9.77 ; 25.55,10.25 26.02,9.77 ; 25.55,10.25 25.14,9.85 25.14,9.77 ; 25.55,10.25 U4.5 ; 26.02,9.77 25.47,9.77 ; 26.02,9.77 C1.2 ; 25.47,9.77 25.14,9.77 ; 25.14,9.77 24.51,9.77 23.95,10.34 U4.3 23.95,16.32 24.75,17.12 U4.21
  Top Layer w0.762: BTTN5.2 37.83,22.33 35.07,19.57 POWERDECK1.2 35.07,15.72 36.32,14.47 39.75,14.47 40.8,13.42 U3.1 U1.1 40.77,9.86 40.77,7.74 40.62,7.59 BTTN6.2 40.65,4.91 40.65,4.06 ; 29.37,4.11 29.37,3.17 ; 29.37,4.11 29.44,4.19 29.44,4.33 ; 29.37,4.11 28.42,3.17 ; 29.37,3.17 30.61,3.17 ; 29.37,3.17 28.42,3.17 ; 30.61,3.17 29.44,4.33 ; 30.61,3.17 39.92,3.17 ; 29.44,4.33 JSSTAND.3 29.44,6.45 30.92,7.93 C1.2 ; 39.92,3.17 39.92,3.34 40.65,4.06 ; 39.92,3.17 40.65,3.17 ; 40.65,4.06 41.55,3.17 ; 40.65,4.06 40.65,3.17 ; 40.65,3.17 41.55,3.17 ; 41.55,3.17 48.13,3.17 48.87,3.91 BATTERY.2 48.87,8.27 48.26,8.88 C2.2 49.46,10.72 50.93,12.19 50.93,13.46 50.05,14.33 U2.1 ; 28.42,3.17 8.76,3.17 6.1,5.84 NRF24.2
  Bottom Layer w0.762: NRF24.2 11.81,11.3 J1.6
BT1: length 14.9
  Top Layer w0.381: U4.30 19.12,15.18 11.11,7.17 BTTNDECK.1
BT2: length 13
  Top Layer w0.381: BTTNDECK.2 13.61,8.65 19.34,14.38 U4.31
BT3: length 11
  Top Layer w0.381: U4.32 19.55,13.58 16.13,10.15 16.13,5.22 BTTNDECK.3
BT4: length 8.4
  Top Layer w0.381: U4.1 22.35,10.78 18.61,7.05 BTTNDECK.4
BT5: length 33.2
  Top Layer w0.381: U4.2 23.15,9.7 v1(23.9,8.95)
  Bottom Layer w0.381: v1(23.9,8.95) 24.02,8.82 32.96,8.82 39.14,15 39.14,19.79 35.33,23.6 BTTN5.1
BT6: length 14.6
  Top Layer w0.381: BTTN6.1 36.58,4.95 35.31,6.22 35.31,8.38 33.4,10.28 33.4,12.31 32.14,13.58 U4.9
CE0: length 27.8
  Top Layer w0.381: U4.13 29.55,16.76 v1(31.11,16.76)
  Bottom Layer w0.254: NRF24.4 8.38,13.84 9.65,15.11 15.37,15.11 17.02,16.76 v1(31.11,16.76)
JSX1: length 30.9
  Top Layer w0.381: v1(16.23,14.65) 16.23,20.79 17.91,22.47 22.48,22.47 23.15,21.81 U4.23
  Bottom Layer w0.381: v1(16.23,14.65) 16.23,10.06 19.18,7.11 24,7.11 24.44,6.66 JSSTAND.1
JSX2: length 10.1
  Top Layer w0.381: U4.25 20.15,19.18 v1(18.65,20.68)
  Bottom Layer w0.381: JSDECK.1 15.09,25.03 18.65,21.48 v1(18.65,20.68)
JSY1: length 30.4
  Top Layer w0.381: v1(17.12,15.47) 17.12,20.67 18.29,21.84 22.1,21.84 22.35,21.59 U4.24
  Bottom Layer w0.381: JSSTAND.2 27.05,5.18 27.05,7.36 26.42,7.99 19.56,7.99 17.12,10.44 v1(17.12,15.47)
JSY2: length 12.9
  Top Layer w0.381: v1(17.98,20.14) 19.74,18.38 U4.26
  Bottom Layer w0.381: v1(17.98,20.14) 16.69,20.14 12.59,24.23 JSDECK.2
MISO0: length 47.7
  Top Layer w0.381: v1(31.36,21.39) 31.36,19.92 30.61,19.17 29.52,19.17
  Bottom Layer w0.381: NRF24.8 6.1,26.28 7.87,28.06 28.58,28.06 31.36,25.28 v1(31.36,21.39)
  Bottom Layer w0.762: J1.1 NRF24.8
MK1_1: length 35
  Top Layer w0.762: NRF24.1 3.55,11.3 2.41,11.3 1.27,12.44 1.27,22.47 3.68,24.89 20.83,24.89 SW2.1
MOSI0: length 31.2
  Top Layer w0.254: NRF24.5 4.83,15.11 13.59,15.11 14.35,15.87 14.35,16.12
  Top Layer w0.381: U4.15 31.15,18.38 v1(31.17,18.4)
  Bottom Layer w0.381: v1(31.17,18.4) 21.96,18.4 20.95,17.39 15.37,17.39 J1.4
R2_1: length 2
  Top Layer w0.762: R2.1 37.21,11.8 U3.2
RESET: length 12.3
  Top Layer w0.381: 11.81,13.58 11.81,12.19 12.32,11.68 14.61,11.68 18.9,15.98 U4.29
SCK0: length 34.6
  Top Layer w0.381: 8.89,17.18 8.26,16.55 8.26,16.38 ; 8.89,17.18 9.66,16.41 9.66,16.38 ; 8.89,17.18 8.89,21.71 10.29,23.11 26.8,23.11 27.95,21.96 U4.17 ; 8.89,17.18 8.89,16.46 8.97,16.38
  Top Layer w0.762: J1.3 NRF24.6
SS0: length 48.1
  Top Layer w0.381: U4.14 31.43,17.58 32.89,19.04 32.89,22.22 31.24,23.87 4.56,23.87 2.16,21.47 2.16,14.69 2.89,13.96 3.43,13.96 NRF24.3
U1_2: length 2
  Top Layer w0.762: R1.1 37.21,9.9 U1.2
U2_3: length 19.1
  Top Layer w0.762: 46.37,12.88 46.37,11.44 ; 46.37,12.88 47.05,12.2 47.05,12.12 ; 46.37,12.88 46.37,18.43 46.88,18.93 U2.3 ; 46.37,11.44 BATTERY.1 ; 46.37,11.44 47.05,12.12 ; 47.05,12.12 48.26,12.12
U4_10: length 9.2
  Top Layer w0.381: R1.2 35.05,9.9 34.16,10.79 34.16,12.82 32.61,14.38 U4.10
U4_11: length 8.2
  Top Layer w0.381: U4.11 29.58,15.23 33.27,15.23 35.7,12.81 R2.2

# Board usb_board_32u4_PCB
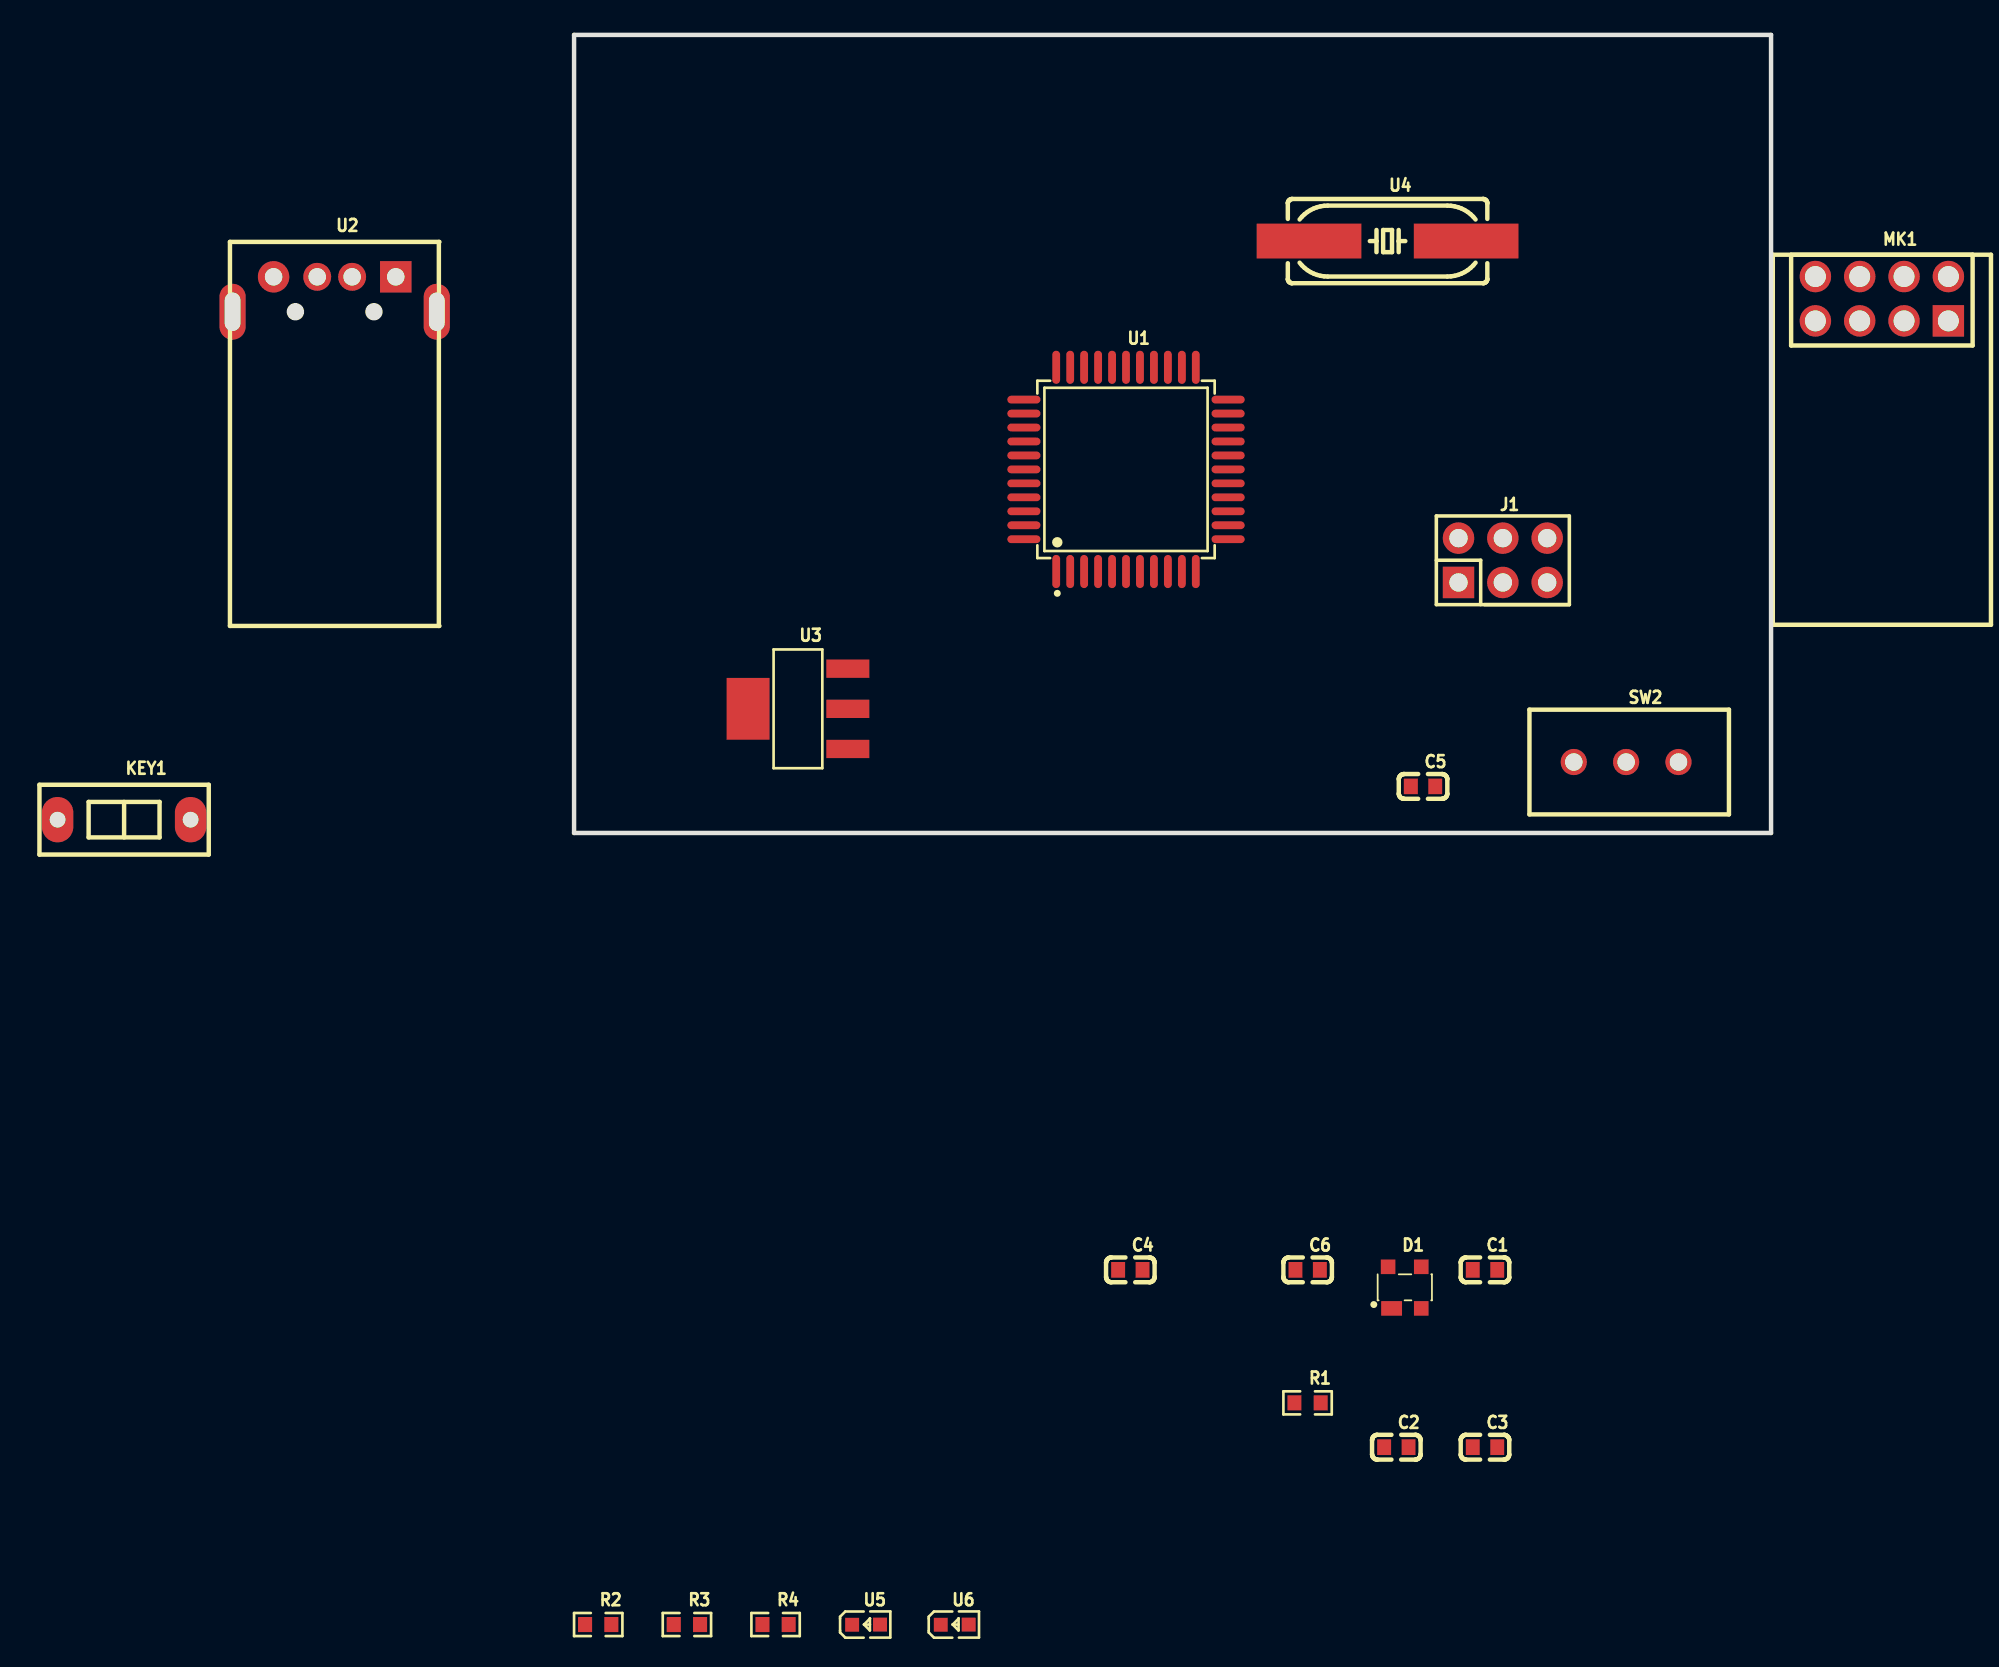
[diagram p6: board, top side]
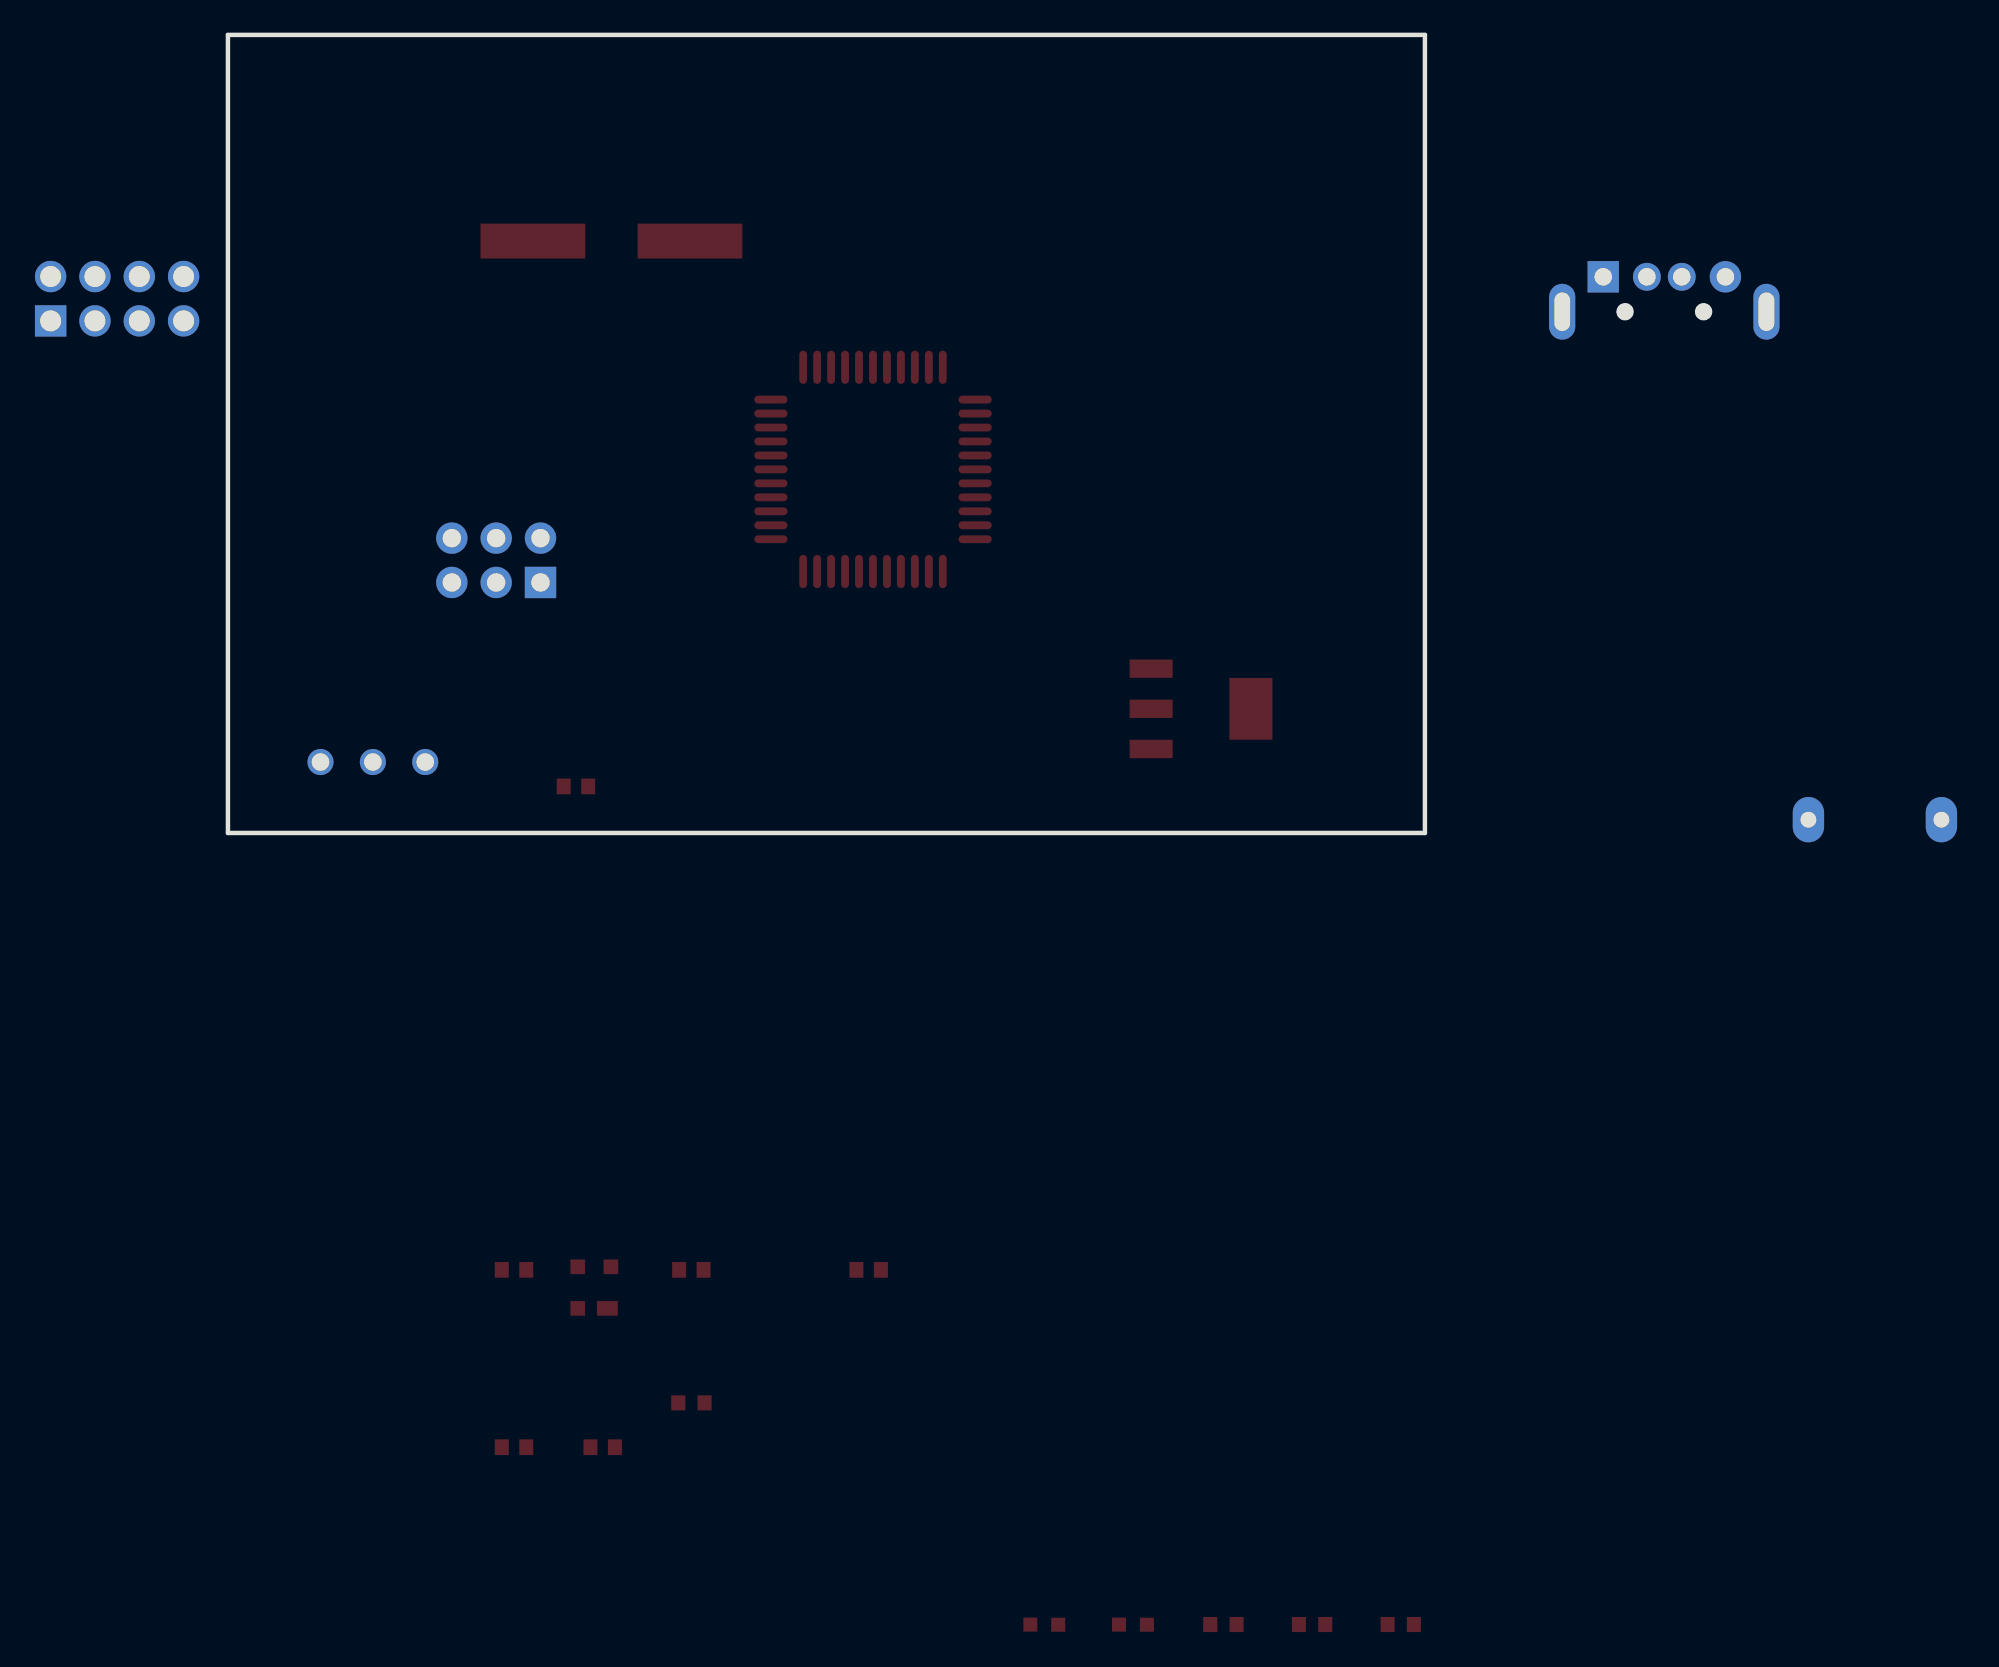
[diagram p7: board, bottom side, seen from below]

Outline 85.04 x 45.72 mm; copper layers: Top Layer, Bottom Layer. Coordinates in mm from the lower left corner of the outline.
Outline path: 16.46,45.72 85.04,45.72 85.04,0 16.46,0 16.46,45.72
Stack: Top Layer 0.035mm / Dielectric1 1.51mm FR4 er 4.5 / Bottom Layer 0.035mm

## Design rules (mm)
spacing Default (default): track to track 0.152, other pairs 0 to 0.152
track width Default (default): min 0.254, default 0.254, max 25.4
differential pair differentialPair (default): width min 0.127, default 0.254, max 2.54; gap min 0.152, default 0.152
via Default (default): diameter min 0.61, default 0.61, max 100.025; hole min 0.305, default 0.305, max 59.995

## Placement (name value [footprint] x y rotation side)
C1  22p  [C0603]  68.65 -25.03 0 top
C2  22p  [C0603]  63.57 -35.19 0 top
C3  10u  [C0603]  68.65 -35.19 0 top
C4  10u  [C0603]  48.33 -25.03 0 top
C5  100u  [C0603]  65.1 2.67 0 top
C6  1u  [C0603]  58.49 -25.03 0 top
D1  PRTR5V0U2X-MS  [SOT-143-4_L2.9-W1.3-P1.92-LS2.4-BL]  64.05 -26.05 0 top
J1  Header-Male-2.54_2x3  [HDR-TH_6P-P2.54-V-M-R2-C3-S2.54-1]  69.67 15.62 0 top
KEY1  K2-3.6×6.1_SMD  [EDG101S]  -9.32 0.76 0 top
MK1  NRF24L01  [WIRELM-SMD_NRF24L01]  91.39 30.61 0 top
R1  22  [R0603]  58.49 -32.65 0 top
R2  22  [R0603]  17.85 -45.35 0 top
R3  1k  [R0603]  22.93 -45.35 0 top
R4  1k  [R0603]  28.01 -45.35 0 top
SW2  POWER SWITCH RADIO  [KLS7-SS02-12F20 (1P2T)]  73.74 4.06 0 top
U1  ATMEGA32U4-AU  [QFP-44_L10.0-W10.0-P0.80-LS13.2-BL]  48.08 20.83 0 top
U2  USB-106-W-FE  [USB-A-TH_USB-106]  2.75 30.86 0 top
U3  TS1117BCW33 RPG  [SOT-223_L6.5-W3.5-P2.30-LS7.0-BR]  29.29 7.11 0 top
U4  -  [HC-49SMD_L11.1-W4.8]  63.07 33.91 0 top
U5  0603  [LED0603-RD_RED]  33.19 -45.36 0 top
U6  0603  [LED0603-RD_RED]  38.27 -45.36 0 top

## Footprints (pads in the part's own frame, mm; a bottom-side part is the same pattern mirrored in y, then rotated)
C0603
  rect 0.8x0.9 smd: 1(-0.7,0) 2(0.7,0)
EDG101S
  oval 1.8x2.6 hole 0.9: 1(-3.81,0) 2(3.81,0)
HC-49SMD_L11.1-W4.8
  rect 6x2 smd: 1(-4.5,0) 2(4.5,0)
HDR-TH_6P-P2.54-V-M-R2-C3-S2.54-1
  rect 1.8x1.8 hole 1.05: 1(-2.54,-1.27)
  round 1.8 hole 1.05: 2(-2.54,1.27) 3(0,-1.27) 4(0,1.27) 5(2.54,-1.27) 6(2.54,1.27)
KLS7-SS02-12F20 (1P2T)
  round 1.5 hole 1: 1(0,0) 2(3,0) 3(6,0)
LED0603-RD_RED
  rect 0.8x0.8 smd: 1(-0.799,-0.004) 2(0.799,0.004)
QFP-44_L10.0-W10.0-P0.80-LS13.2-BL
  oval 0.45x1.9 smd: 1(-4,-5.85) 2(-3.2,-5.85) 3(-2.4,-5.85) 4(-1.6,-5.85) 5(-0.8,-5.85) 6(0,-5.85) 7(0.8,-5.85) 8(1.6,-5.85) 9(2.4,-5.85) 10(3.2,-5.85) 11(4,-5.85) 23(4,5.85) 24(3.2,5.85) 25(2.4,5.85) 26(1.6,5.85) 27(0.8,5.85) 28(0,5.85) 29(-0.8,5.85) 30(-1.6,5.85) 31(-2.4,5.85) 32(-3.2,5.85) 33(-4,5.85)
  oval 1.9x0.45 smd: 12(5.85,-4) 13(5.85,-3.2) 14(5.85,-2.4) 15(5.85,-1.6) 16(5.85,-0.8) 17(5.85,0) 18(5.85,0.8) 19(5.85,1.6) 20(5.85,2.4) 21(5.85,3.2) 22(5.85,4) 34(-5.85,4) 35(-5.85,3.2) 36(-5.85,2.4) 37(-5.85,1.6) 38(-5.85,0.8) 39(-5.85,0) 40(-5.85,-0.8) 41(-5.85,-1.6) 42(-5.85,-2.4) 43(-5.85,-3.2) 44(-5.85,-4)
R0603
  rect 0.806x0.864 smd: 1(-0.753,0) 2(0.753,0)
SOT-143-4_L2.9-W1.3-P1.92-LS2.4-BL
  rect 1.194x0.838 smd: 1(-0.75,-1.192)
  rect 0.838x0.838 smd: 2(0.95,-1.192) 3(0.95,1.192) 4(-0.95,1.192)
SOT-223_L6.5-W3.5-P2.30-LS7.0-BR
  rect 2.465x1.05 smd: 1(2.857,-2.3) 2(2.857,0) 3(2.857,2.3)
  rect 2.465x3.54 smd: 4(-2.857,0)
USB-A-TH_USB-106
  rect 1.8x1.8 hole 1: 1(3.5,1)
  round 1.6 hole 1: 2(1,1) 3(-1,1)
  round 1.8 hole 1: 4(-3.5,1)
  oval 1.5x3.2 hole 0.9x2.2: 5(-5.85,-1) 6(5.85,-1)
WIRELM-SMD_NRF24L01
  rect 1.8x1.8 hole 1.2: 1(3.808,-1.27)
  round 1.8 hole 1.2: 2(3.81,1.27) 3(1.27,-1.27) 4(1.27,1.27) 5(-1.27,-1.27) 6(-1.27,1.27) 7(-3.81,-1.27) 8(-3.81,1.27)

## Nets
3.3V: C5.1 SW2.2 U3.2 U3.4
5V: C3.1 C4.1 D1.4 J1.2 U1.2 U1.7 U1.14 U1.24 U1.44 U2.1 U3.3
GND: C1.2 C2.2 C3.2 C4.2 C5.2 C6.1 D1.1 J1.6 MK1.2 U1.5 U1.15 U2.4 U3.1 U5.1 U6.1
CE0: MK1.4 U1.28
D+: D1.3 R2.1 U2.3
D-: D1.2 R1.1 U2.2
KEY1_1: KEY1.1
KEY1_2: KEY1.2
MISO0: J1.1 MK1.8 U1.11
MK1_1: MK1.1
MK1_7: MK1.7
MOSI0: J1.4 MK1.5 U1.10
R3_2: R3.2 U5.2
R4_2: R4.2 U6.2
RESET: J1.5 U1.13
SCK0: J1.3 MK1.6 U1.9
SS0: MK1.3 U1.8
SW2_1: SW2.1
SW2_3: SW2.3
U1_1: U1.1
U1_3: R1.2 U1.3
U1_4: R2.2 U1.4
U1_6: C6.2 U1.6
U1_12: U1.12
U1_18: R3.1 U1.18
U1_19: R4.1 U1.19
U1_20: U1.20
U1_21: U1.21
U1_22: U1.22
U1_23: U1.23
U1_25: U1.25
U1_26: U1.26
U1_27: U1.27
U1_29: U1.29
U1_30: U1.30
U1_31: U1.31
U1_32: U1.32
U1_33: U1.33
U1_34: U1.34
U1_35: U1.35
U1_36: U1.36
U1_37: U1.37
U1_38: U1.38
U1_39: U1.39
U1_40: U1.40
U1_41: U1.41
U1_42: U1.42
U1_43: U1.43
U2_5: U2.5
U2_6: U2.6
XTAL1: C1.1 U1.17 U4.2
XTAL2: C2.1 U1.16 U4.1

# Board paty_deska
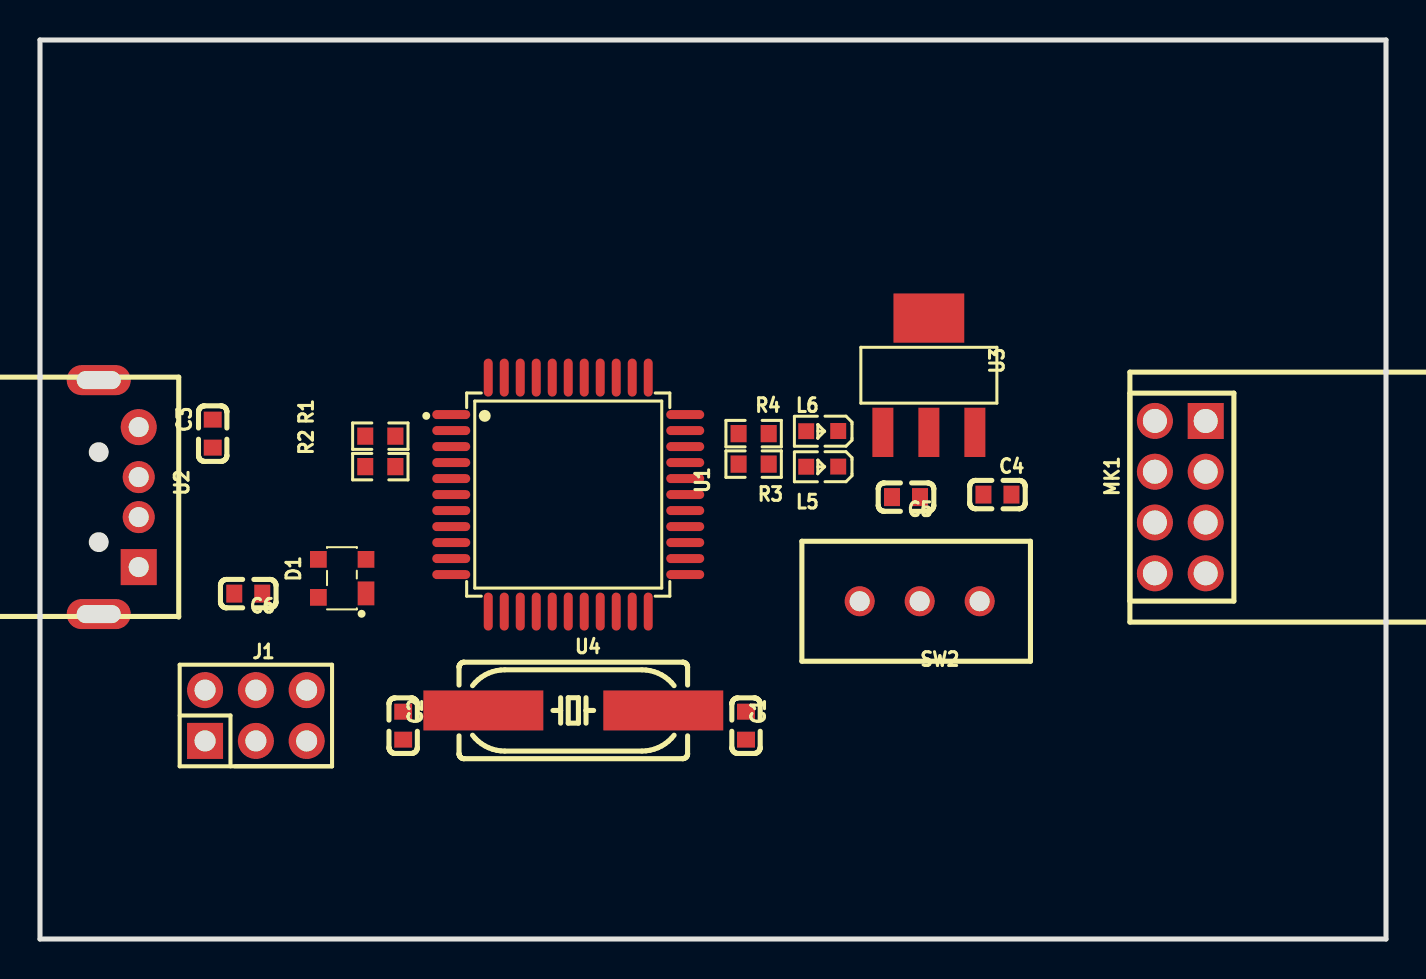
[diagram p8: board, top side]
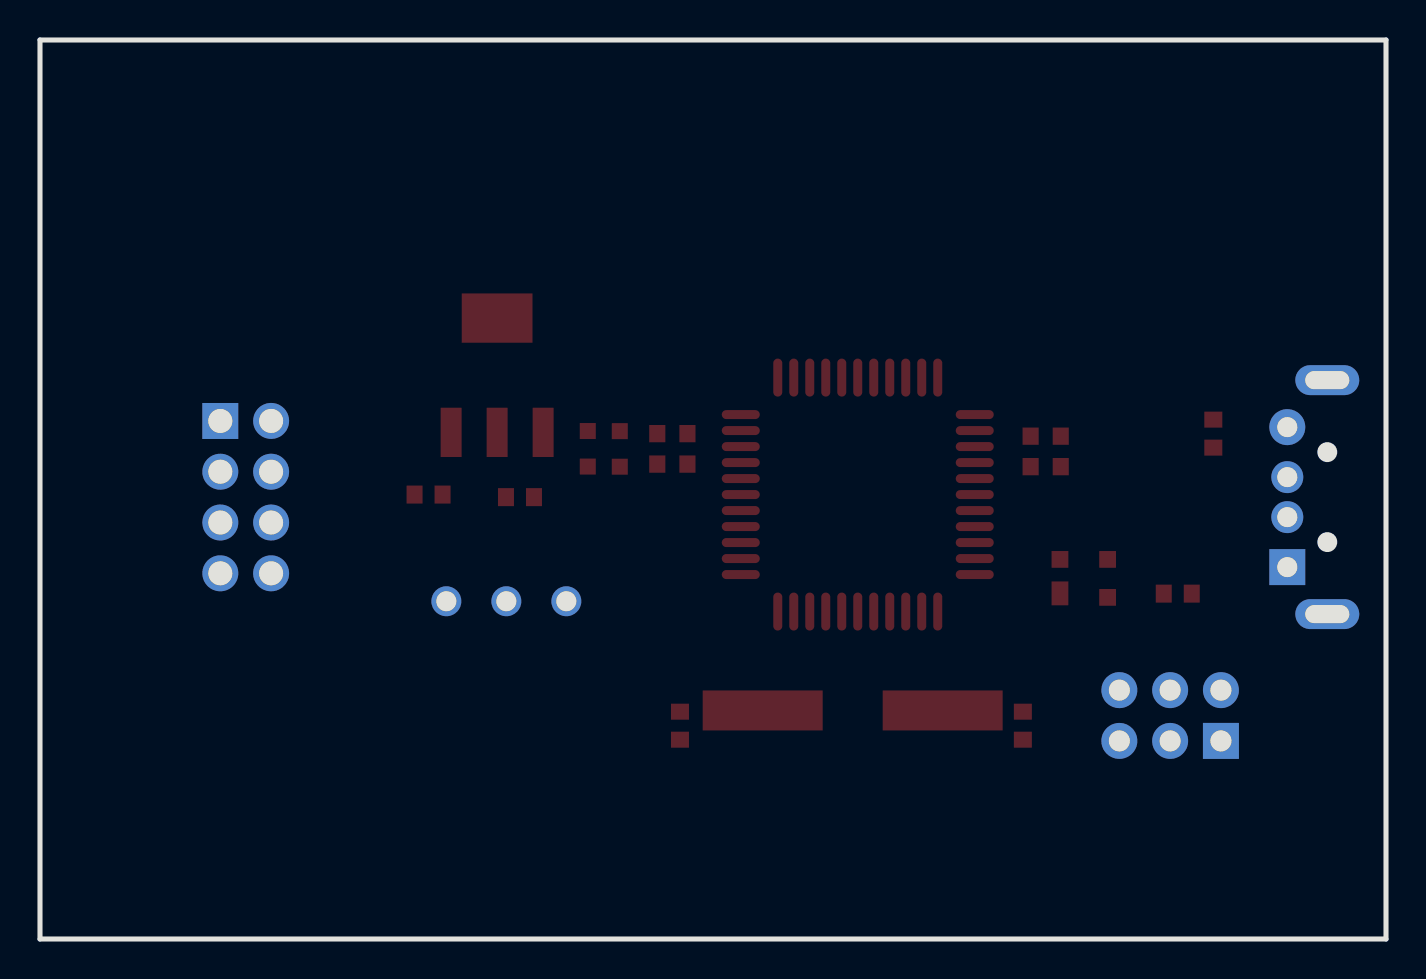
[diagram p9: board, bottom side, seen from below]

Outline 67.31 x 44.96 mm; copper layers: Top Layer, Bottom Layer. Coordinates in mm from the lower left corner of the outline.
Outline path: 0,44.96 67.31,44.96 67.31,0 0,0 0,44.96
Stack: Top Layer 0.035mm / Dielectric1 1.51mm FR4 er 4.5 / Bottom Layer 0.035mm

## Design rules (mm)
spacing Default (default): track to track 0.152, other pairs 0 to 0.152
track width Default (default): min 0.254, default 0.254, max 25.4
differential pair differentialPair (default): width min 0.127, default 0.254, max 2.54; gap min 0.152, default 0.152
via Default (default): diameter min 0.61, default 0.61, max 100.025; hole min 0.305, default 0.305, max 59.995

## Placement (name value [footprint] x y rotation side)
C1  22p  [C0603]  35.31 10.67 270 top
C2  22p  [C0603]  18.16 10.67 270 top
C3  10u  [C0603]  8.64 25.27 90 top
C4  10u  [C0603]  47.88 22.23 0 top
C5  100u  [C0603]  43.31 22.1 180 top
C6  1u  [C0603]  10.41 17.27 180 top
D1  PRTR5V0U2X-MS  [SOT-143-4_L2.9-W1.3-P1.92-LS2.4-BL]  15.11 18.03 90 top
J1  Header-Male-2.54_2x3  [HDR-TH_6P-P2.54-V-M-R2-C3-S2.54-1]  10.79 11.18 0 top
L5  0603  [LED0603-RD_RED]  39.12 23.62 180 top
L6  0603  [LED0603-RD_RED]  39.12 25.4 180 top
MK1  NRF24L01  [WIRELM-SMD_NRF24L01]  57.02 22.1 90 top
R1  22  [R0603]  17.02 25.15 0 top
R2  22  [R0603]  17.02 23.62 0 top
R3  1k  [R0603]  35.69 23.75 0 top
R4  1k  [R0603]  35.69 25.27 0 top
SW2  POWER SWITCH RADIO  [KLS7-SS02-12F20 (1P2T)]  46.99 16.89 180 top
U1  ATMEGA32U4-AU  [QFP-44_L10.0-W10.0-P0.80-LS13.2-BL]  26.42 22.23 270 top
U2  USB-106-W-FE  [USB-A-TH_USB-106]  3.94 22.1 270 top
U3  TS1117BCW33 RPG  [SOT-223_L6.5-W3.5-P2.30-LS7.0-BR]  44.45 28.19 270 top
U4  -  [HC-49SMD_L11.1-W4.8]  26.67 11.43 0 top

## Footprints (pads in the part's own frame, mm; a bottom-side part is the same pattern mirrored in y, then rotated)
C0603
  rect 0.8x0.9 smd: 1(-0.7,0) 2(0.7,0)
HC-49SMD_L11.1-W4.8
  rect 6x2 smd: 1(-4.5,0) 2(4.5,0)
HDR-TH_6P-P2.54-V-M-R2-C3-S2.54-1
  rect 1.8x1.8 hole 1.05: 1(-2.54,-1.27)
  round 1.8 hole 1.05: 2(-2.54,1.27) 3(0,-1.27) 4(0,1.27) 5(2.54,-1.27) 6(2.54,1.27)
KLS7-SS02-12F20 (1P2T)
  round 1.5 hole 1: 1(0,0) 2(3,0) 3(6,0)
LED0603-RD_RED
  rect 0.8x0.8 smd: 1(-0.799,-0.004) 2(0.799,0.004)
QFP-44_L10.0-W10.0-P0.80-LS13.2-BL
  oval 0.45x1.9 smd: 1(-4,-5.85) 2(-3.2,-5.85) 3(-2.4,-5.85) 4(-1.6,-5.85) 5(-0.8,-5.85) 6(0,-5.85) 7(0.8,-5.85) 8(1.6,-5.85) 9(2.4,-5.85) 10(3.2,-5.85) 11(4,-5.85) 23(4,5.85) 24(3.2,5.85) 25(2.4,5.85) 26(1.6,5.85) 27(0.8,5.85) 28(0,5.85) 29(-0.8,5.85) 30(-1.6,5.85) 31(-2.4,5.85) 32(-3.2,5.85) 33(-4,5.85)
  oval 1.9x0.45 smd: 12(5.85,-4) 13(5.85,-3.2) 14(5.85,-2.4) 15(5.85,-1.6) 16(5.85,-0.8) 17(5.85,0) 18(5.85,0.8) 19(5.85,1.6) 20(5.85,2.4) 21(5.85,3.2) 22(5.85,4) 34(-5.85,4) 35(-5.85,3.2) 36(-5.85,2.4) 37(-5.85,1.6) 38(-5.85,0.8) 39(-5.85,0) 40(-5.85,-0.8) 41(-5.85,-1.6) 42(-5.85,-2.4) 43(-5.85,-3.2) 44(-5.85,-4)
R0603
  rect 0.806x0.864 smd: 1(-0.753,0) 2(0.753,0)
SOT-143-4_L2.9-W1.3-P1.92-LS2.4-BL
  rect 1.194x0.838 smd: 1(-0.75,-1.192)
  rect 0.838x0.838 smd: 2(0.95,-1.192) 3(0.95,1.192) 4(-0.95,1.192)
SOT-223_L6.5-W3.5-P2.30-LS7.0-BR
  rect 2.465x1.05 smd: 1(2.857,-2.3) 2(2.857,0) 3(2.857,2.3)
  rect 2.465x3.54 smd: 4(-2.857,0)
USB-A-TH_USB-106
  rect 1.8x1.8 hole 1: 1(3.5,1)
  round 1.6 hole 1: 2(1,1) 3(-1,1)
  round 1.8 hole 1: 4(-3.5,1)
  oval 1.5x3.2 hole 0.9x2.2: 5(-5.85,-1) 6(5.85,-1)
WIRELM-SMD_NRF24L01
  rect 1.8x1.8 hole 1.2: 1(3.808,-1.27)
  round 1.8 hole 1.2: 2(3.81,1.27) 3(1.27,-1.27) 4(1.27,1.27) 5(-1.27,-1.27) 6(-1.27,1.27) 7(-3.81,-1.27) 8(-3.81,1.27)

## Nets
As in the schematic, except:
GND: C1.2 C2.2 C3.2 C4.2 C5.2 C6.1 D1.1 J1.6 L5.1 L6.1 MK1.2 U1.5 U1.15 U2.4 U3.1
R3_2: L5.2 R3.2
R4_2: L6.2 R4.2
U1_18: R3.1 U1.18
U1_19: R4.1 U1.19
